# EAGLE schematic padaukprog (EAGLE 6.4)
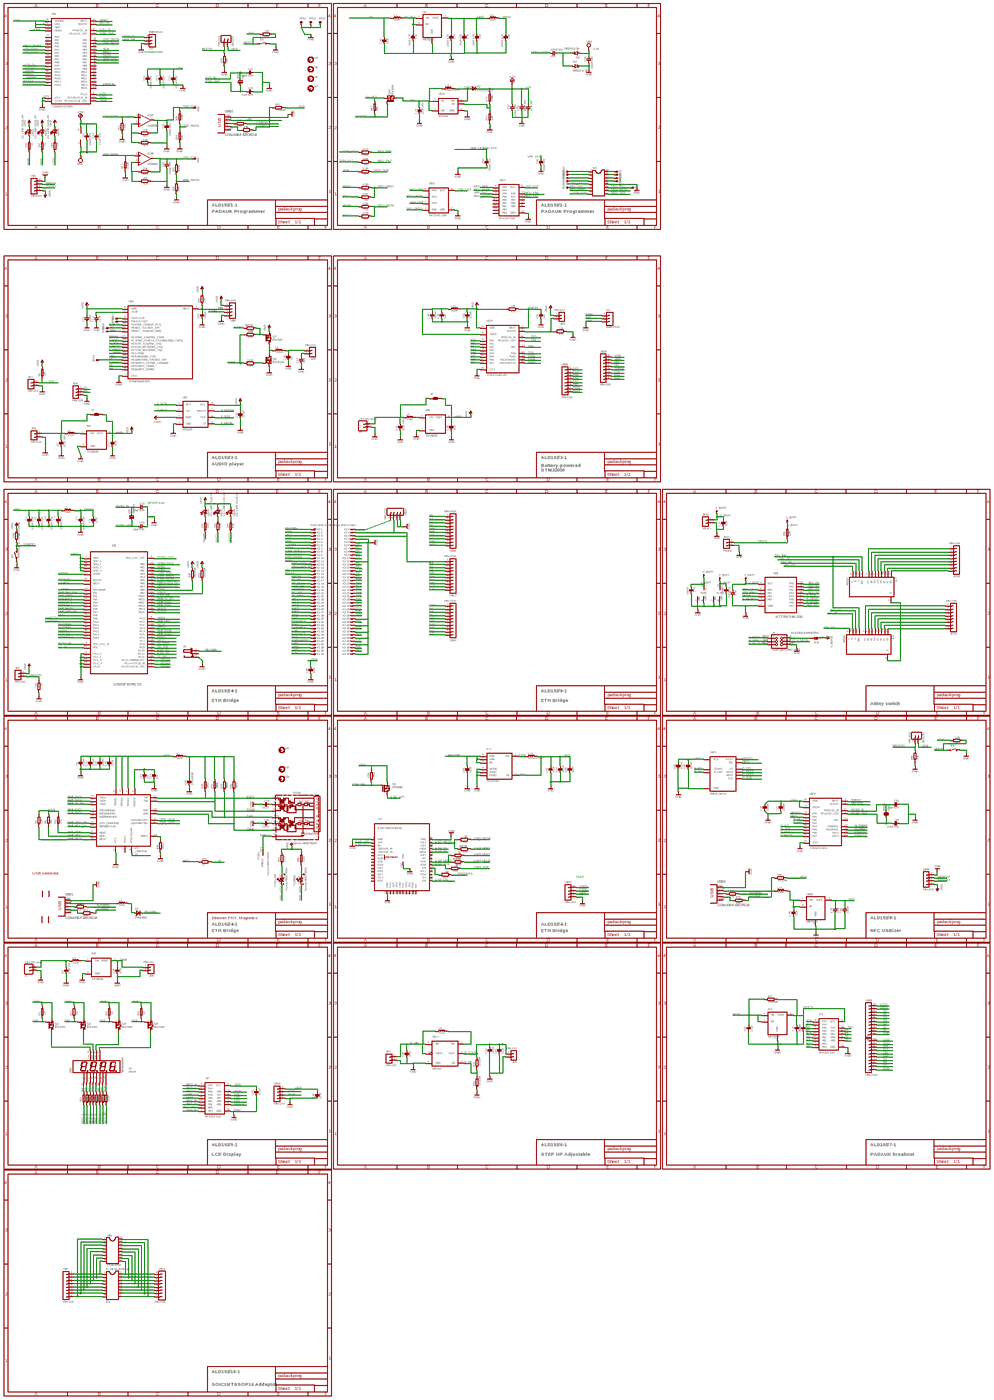
[diagram p0: schematic, sheet 1, overview]
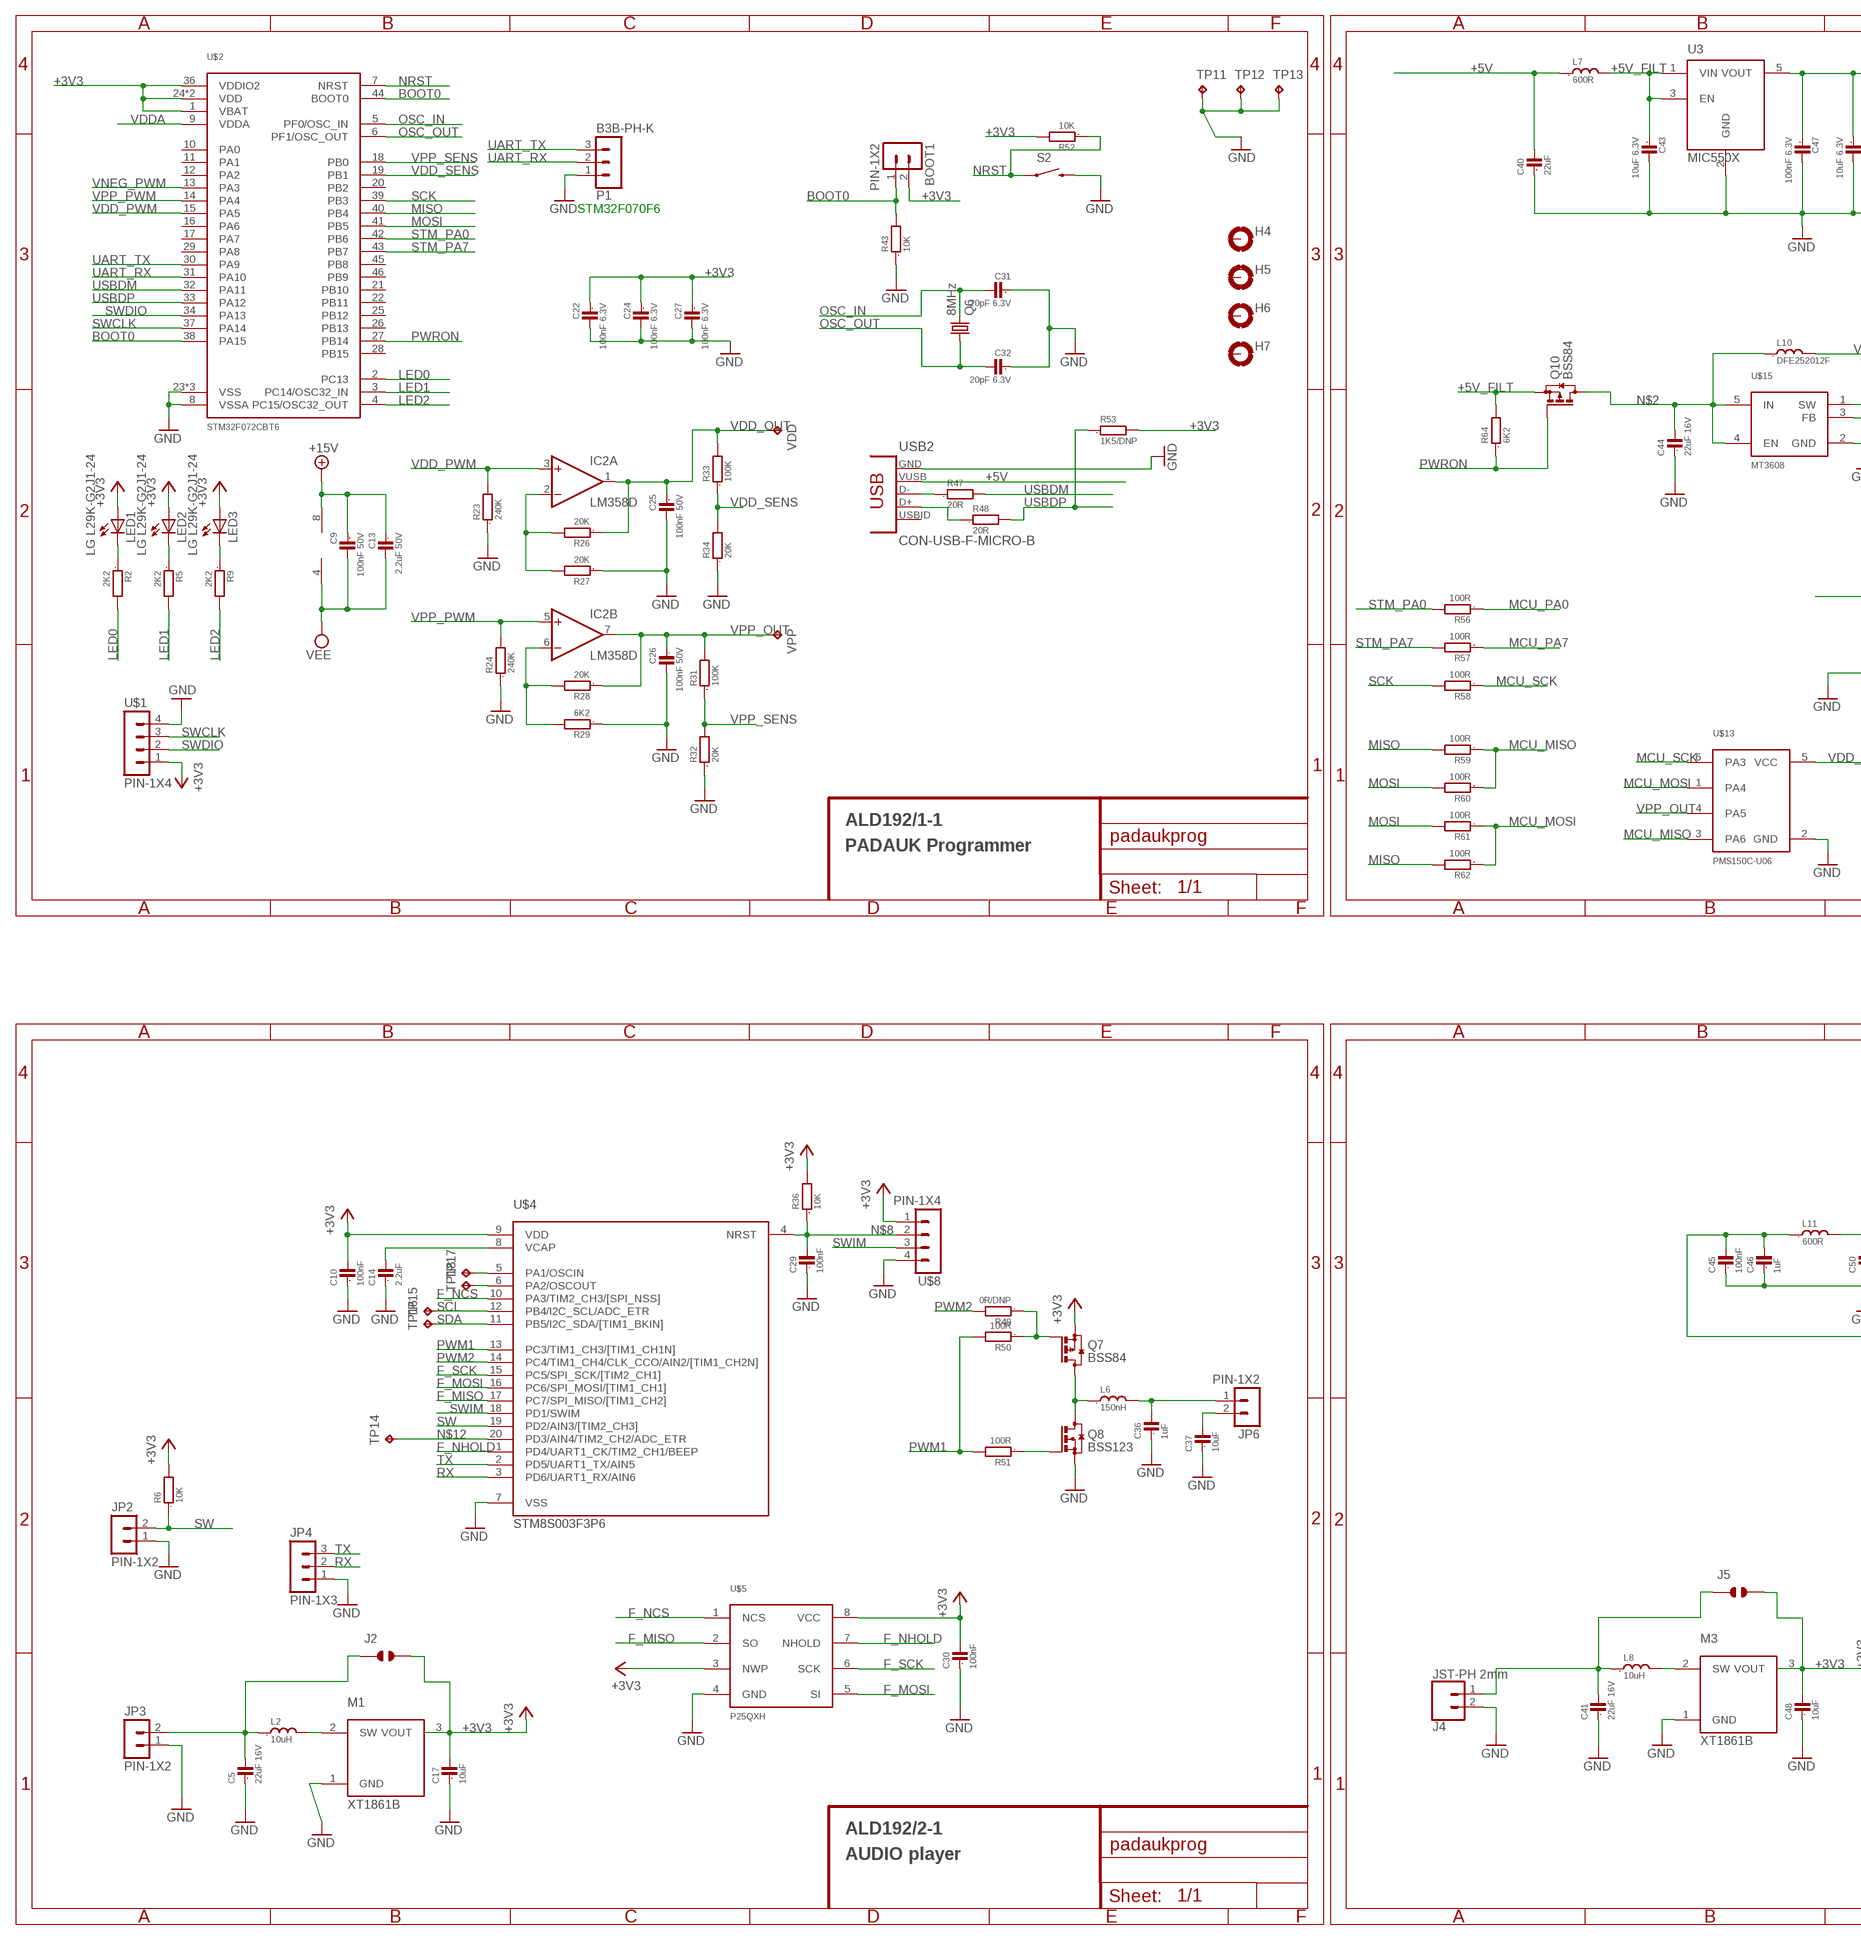
[diagram p1: schematic, sheet 1, part 1 of 7]
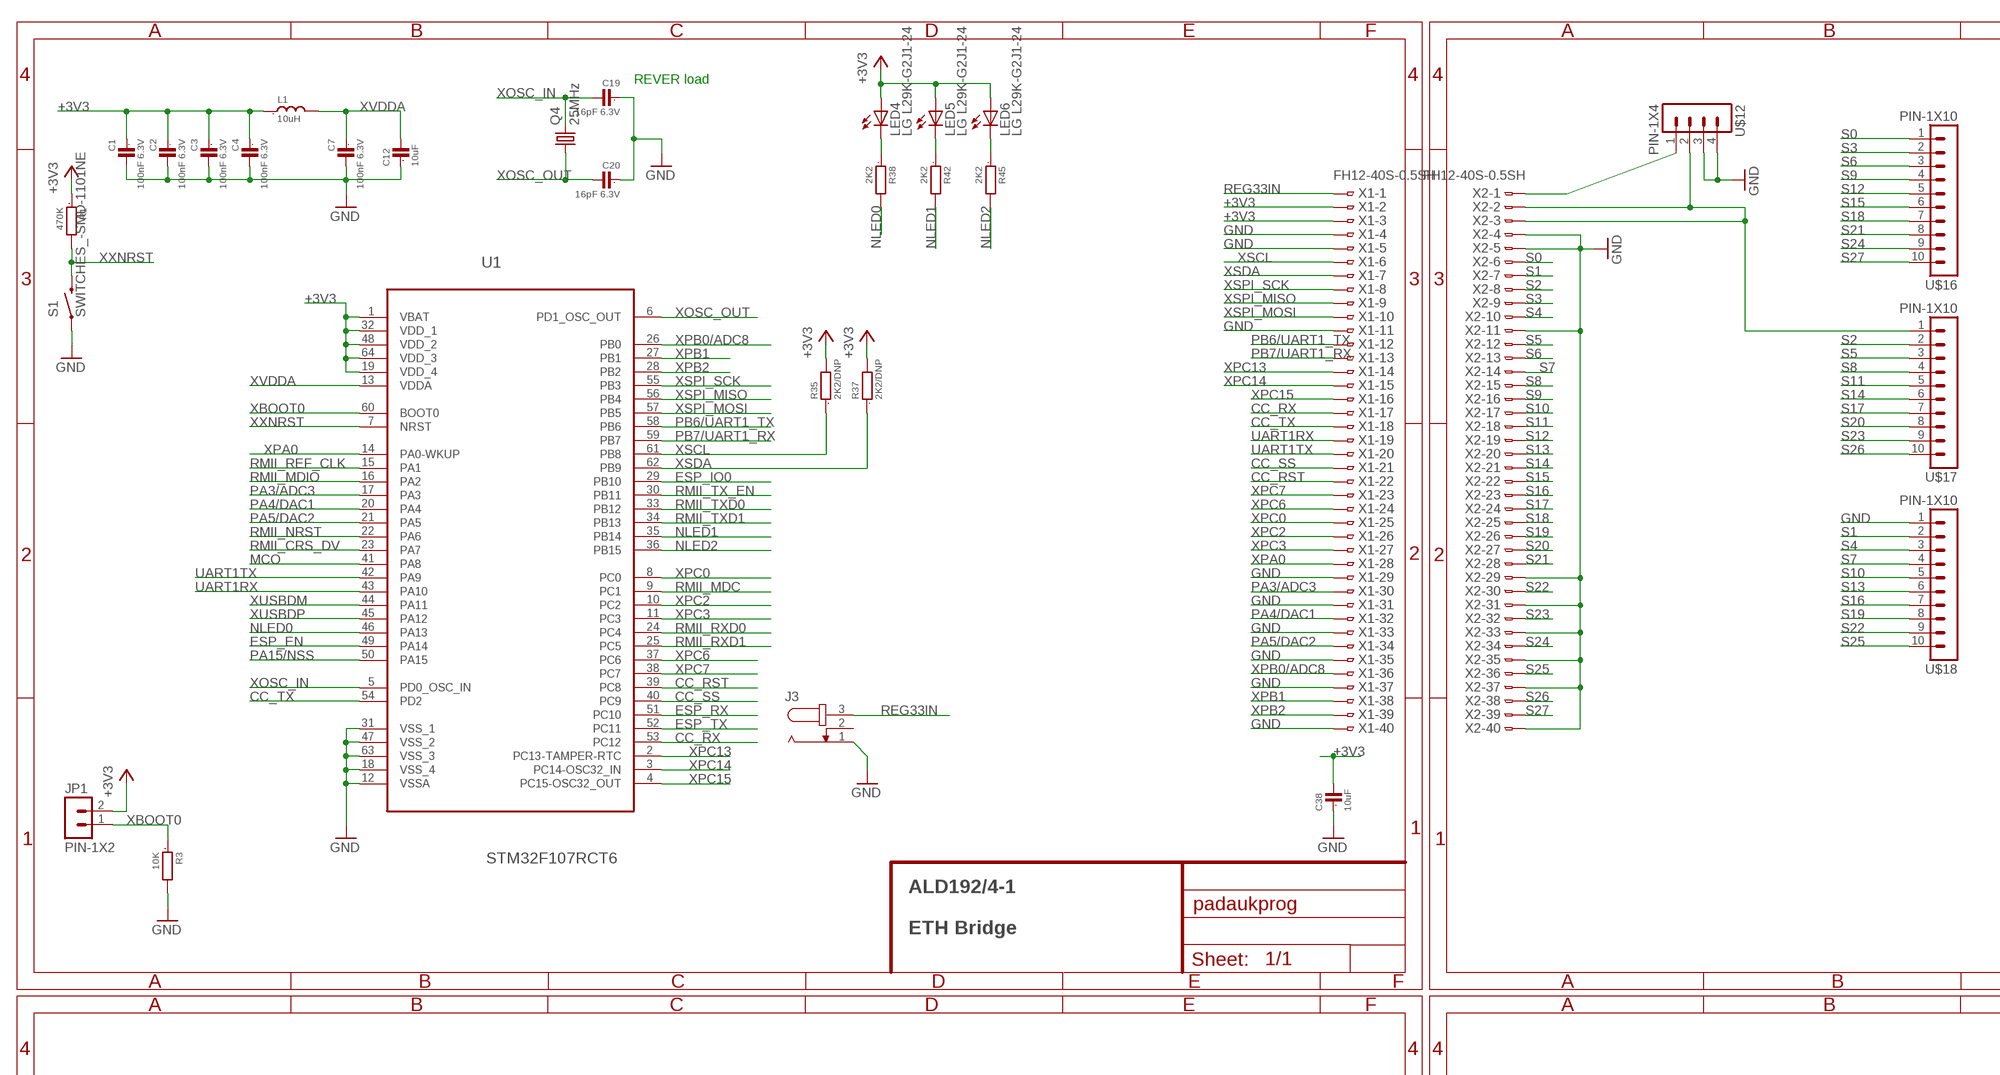
[diagram p2: schematic, sheet 1, part 2 of 7]
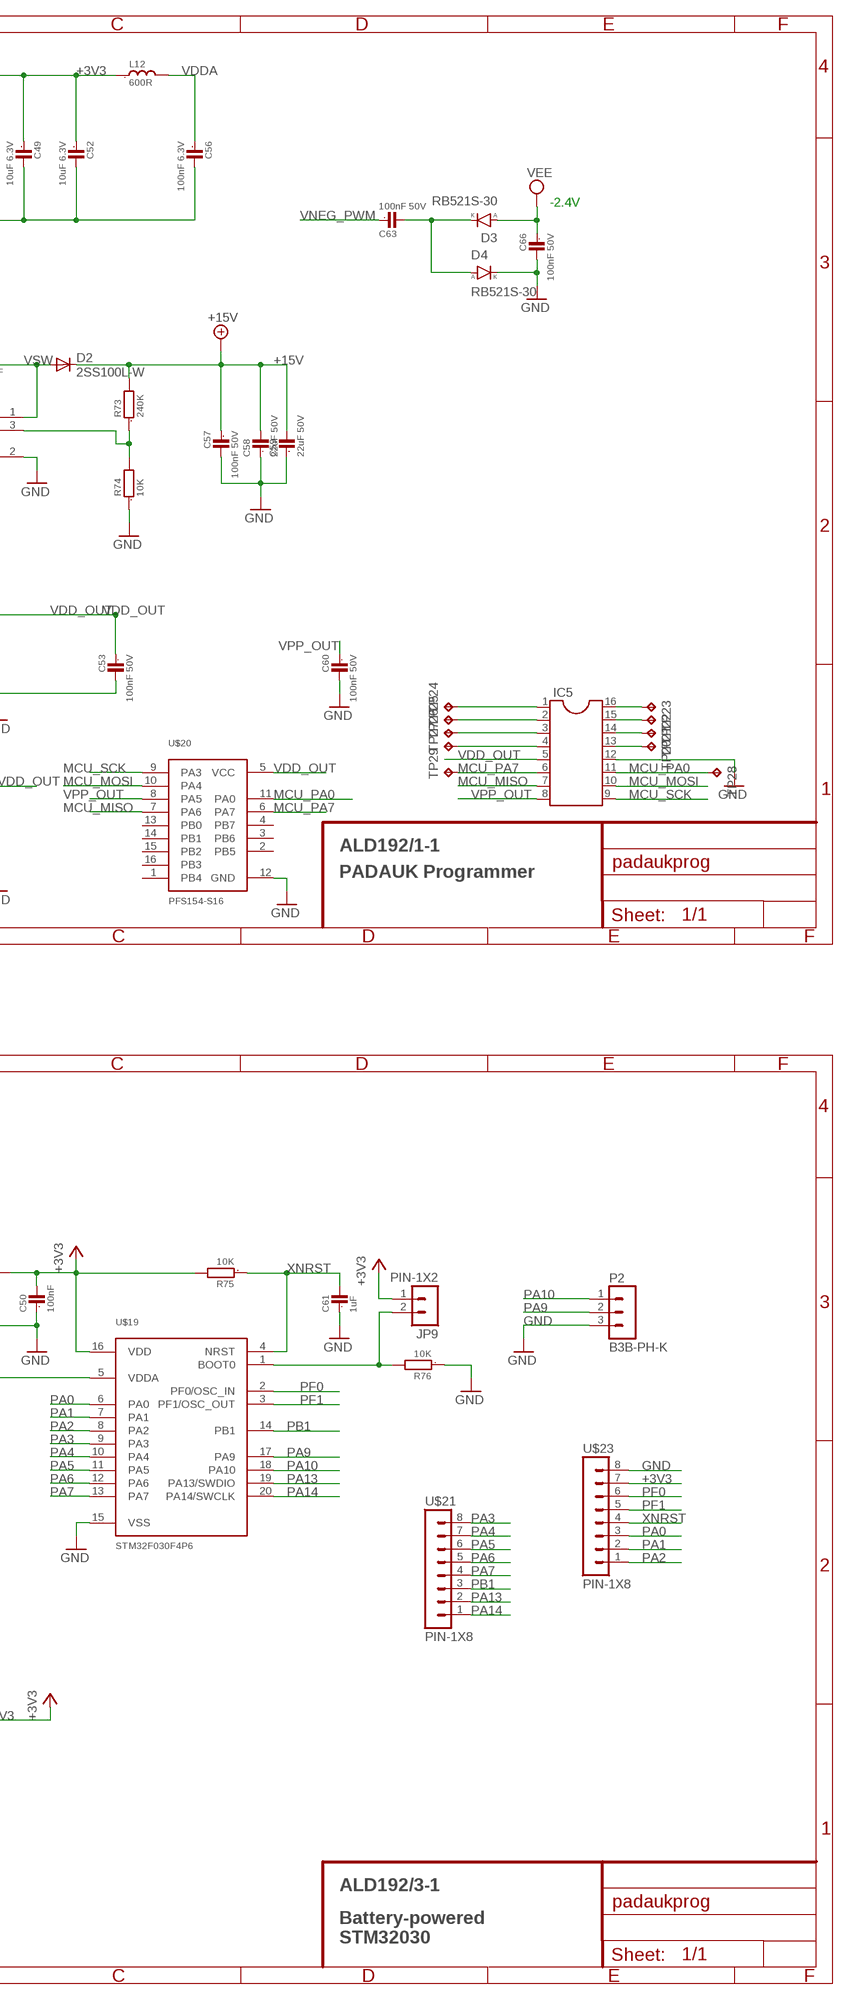
[diagram p3: schematic, sheet 1, part 3 of 7]
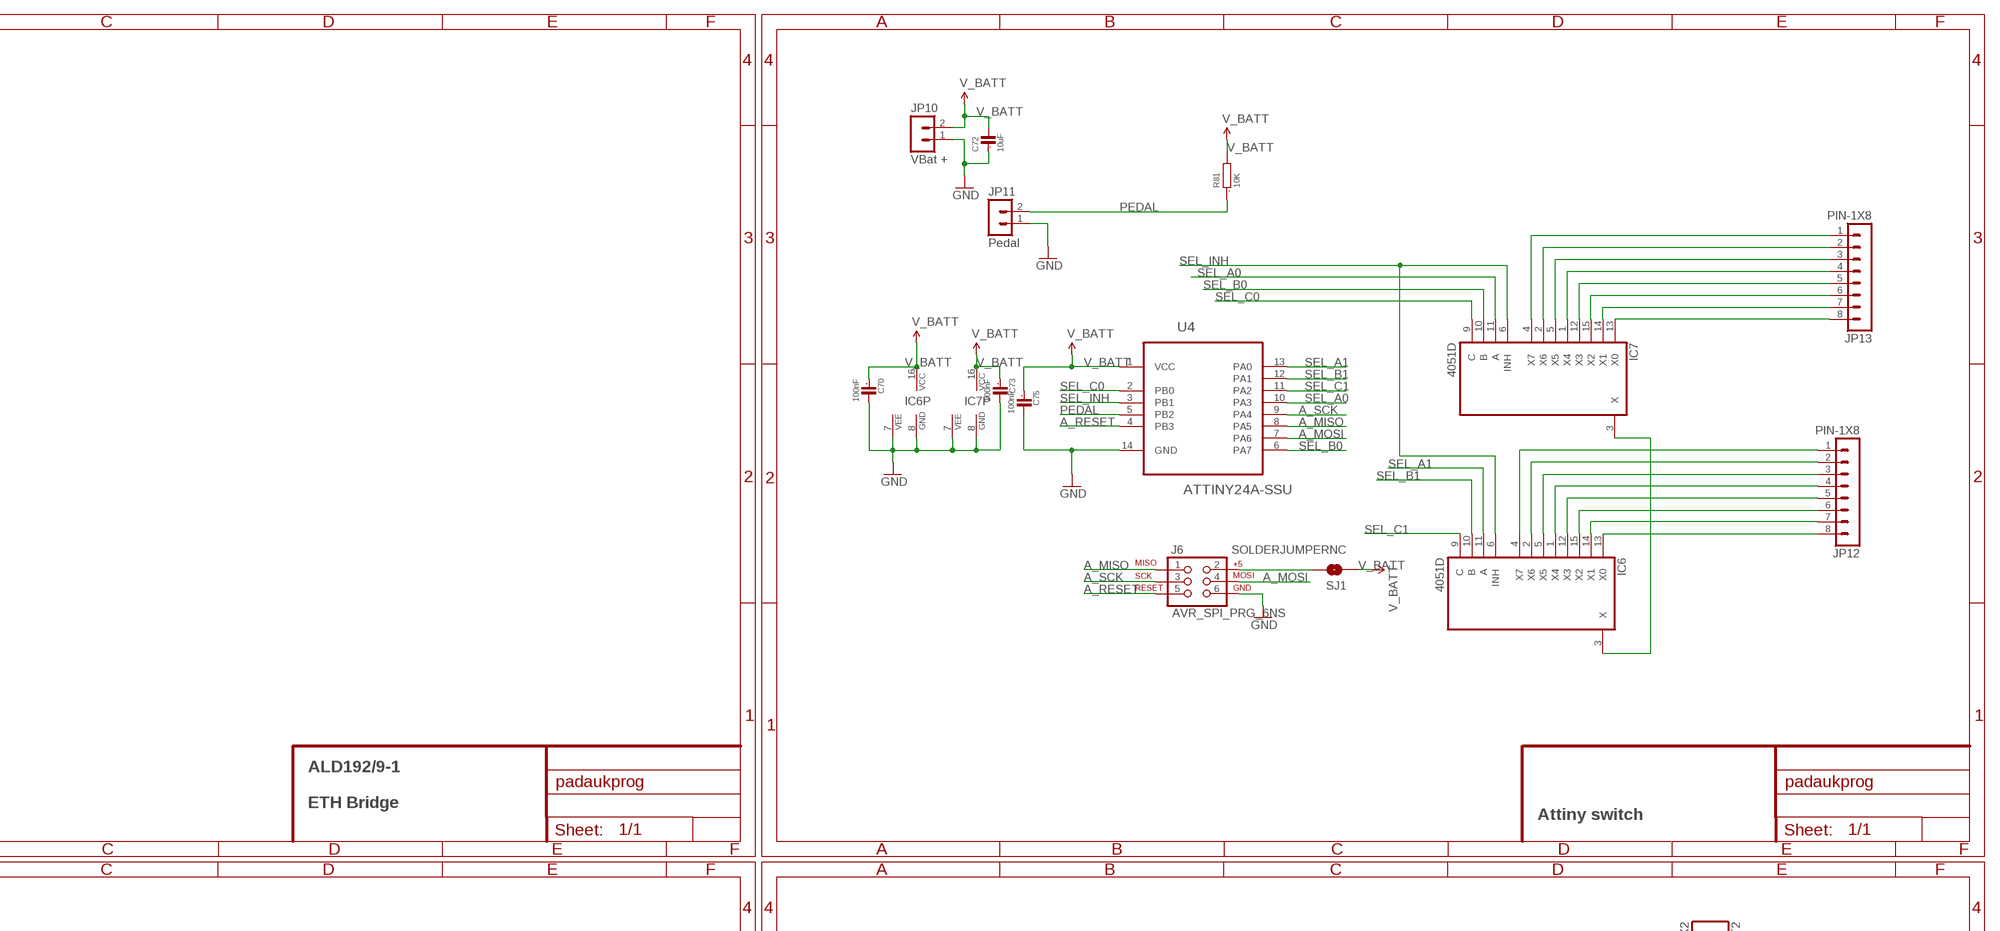
[diagram p4: schematic, sheet 1, part 4 of 7]
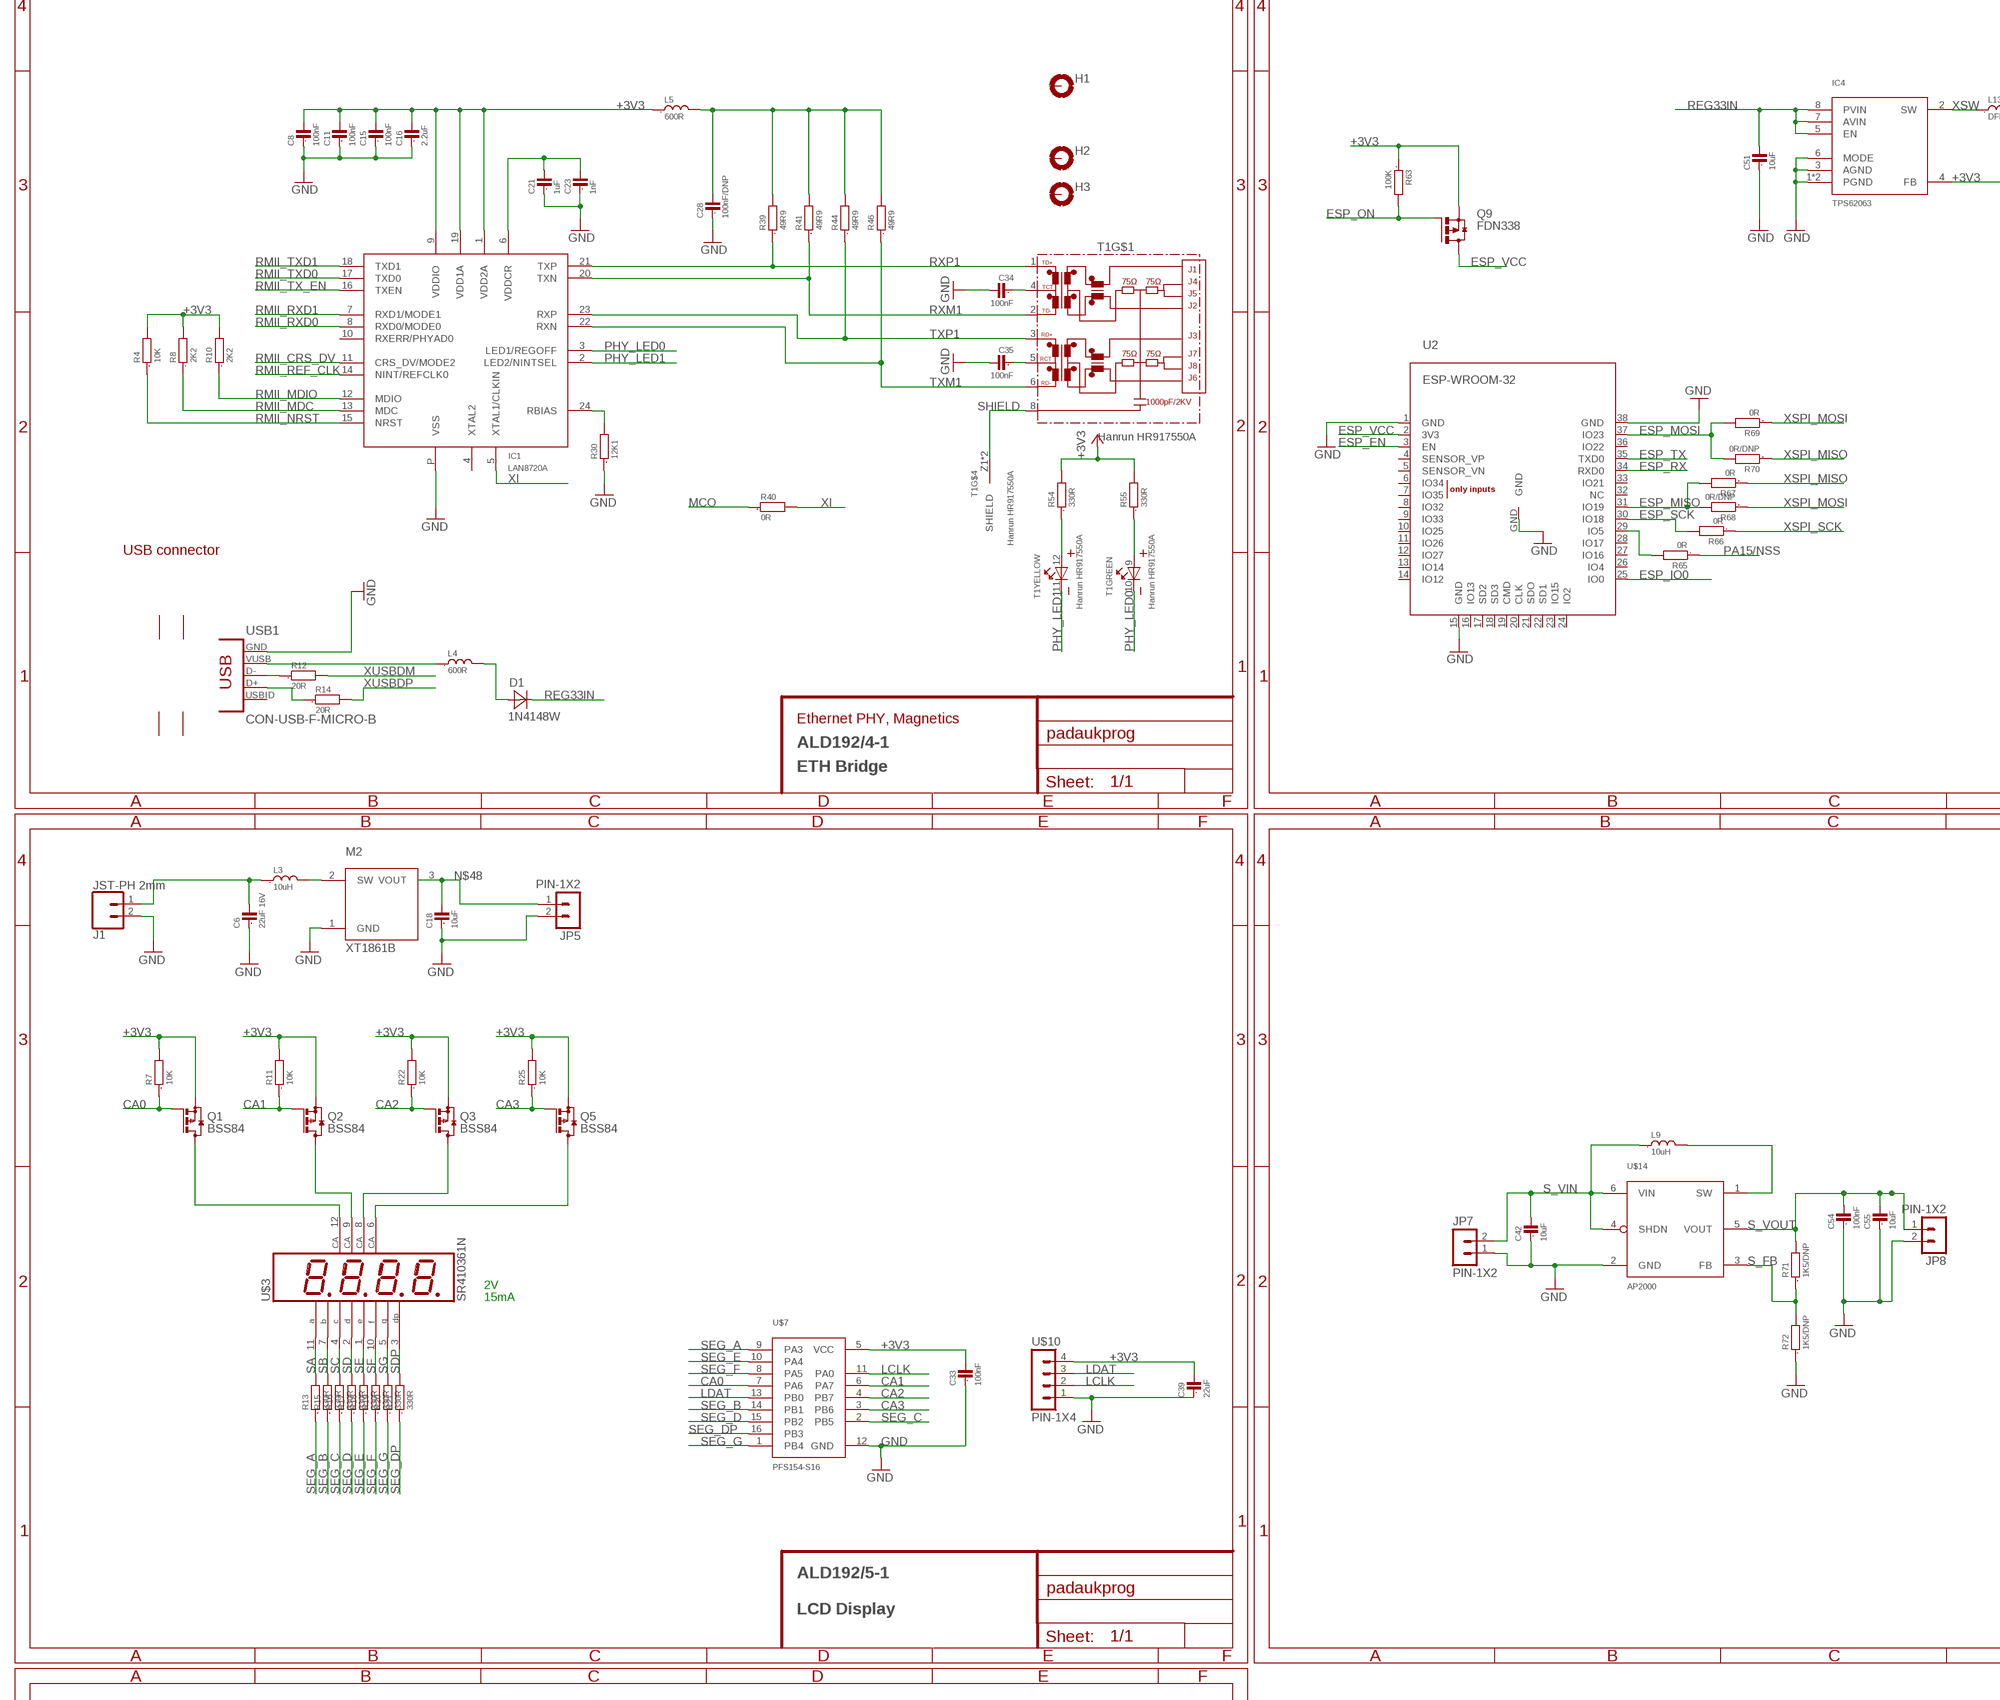
[diagram p5: schematic, sheet 1, part 5 of 7]
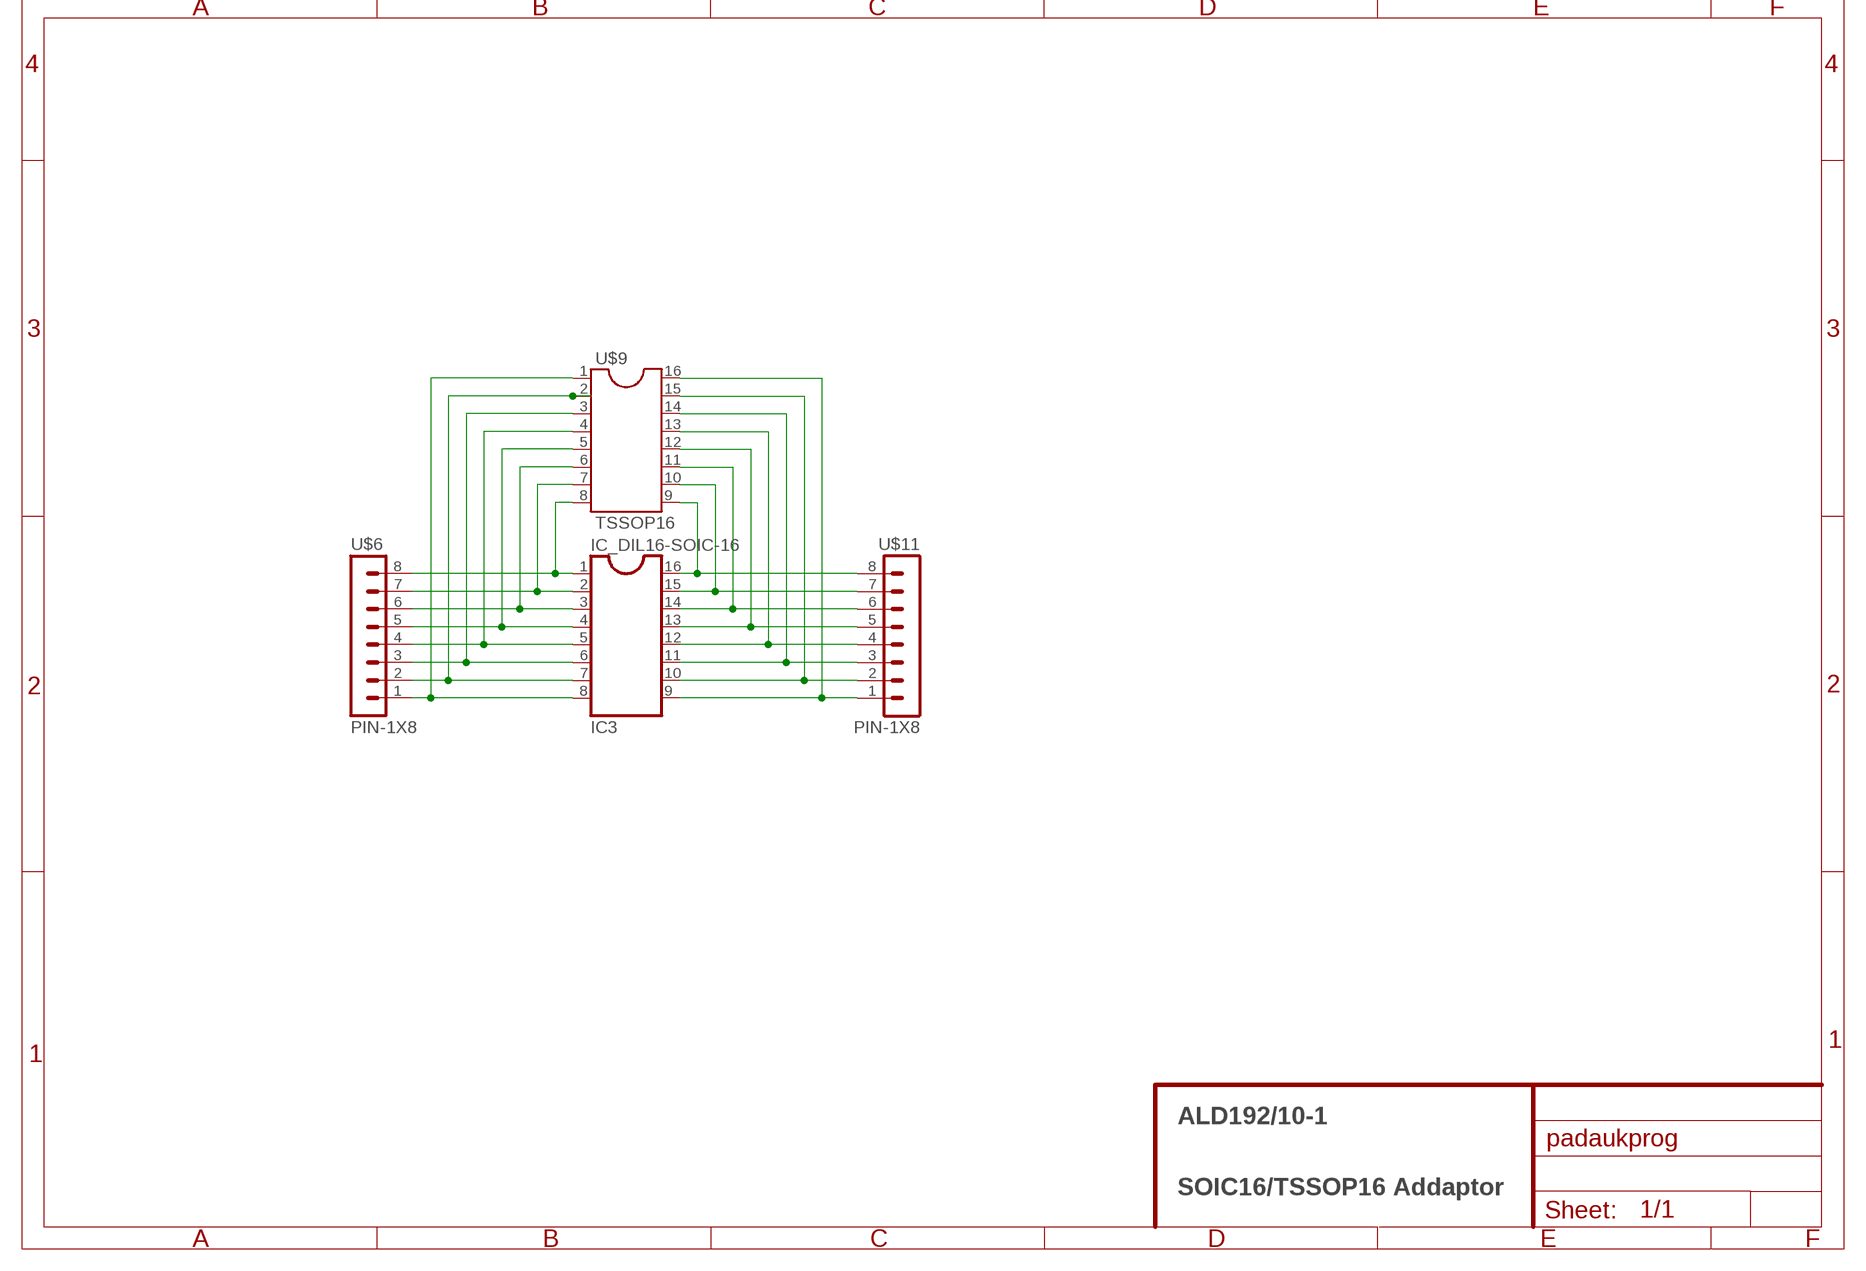
[diagram p6: schematic, sheet 1, part 6 of 7]
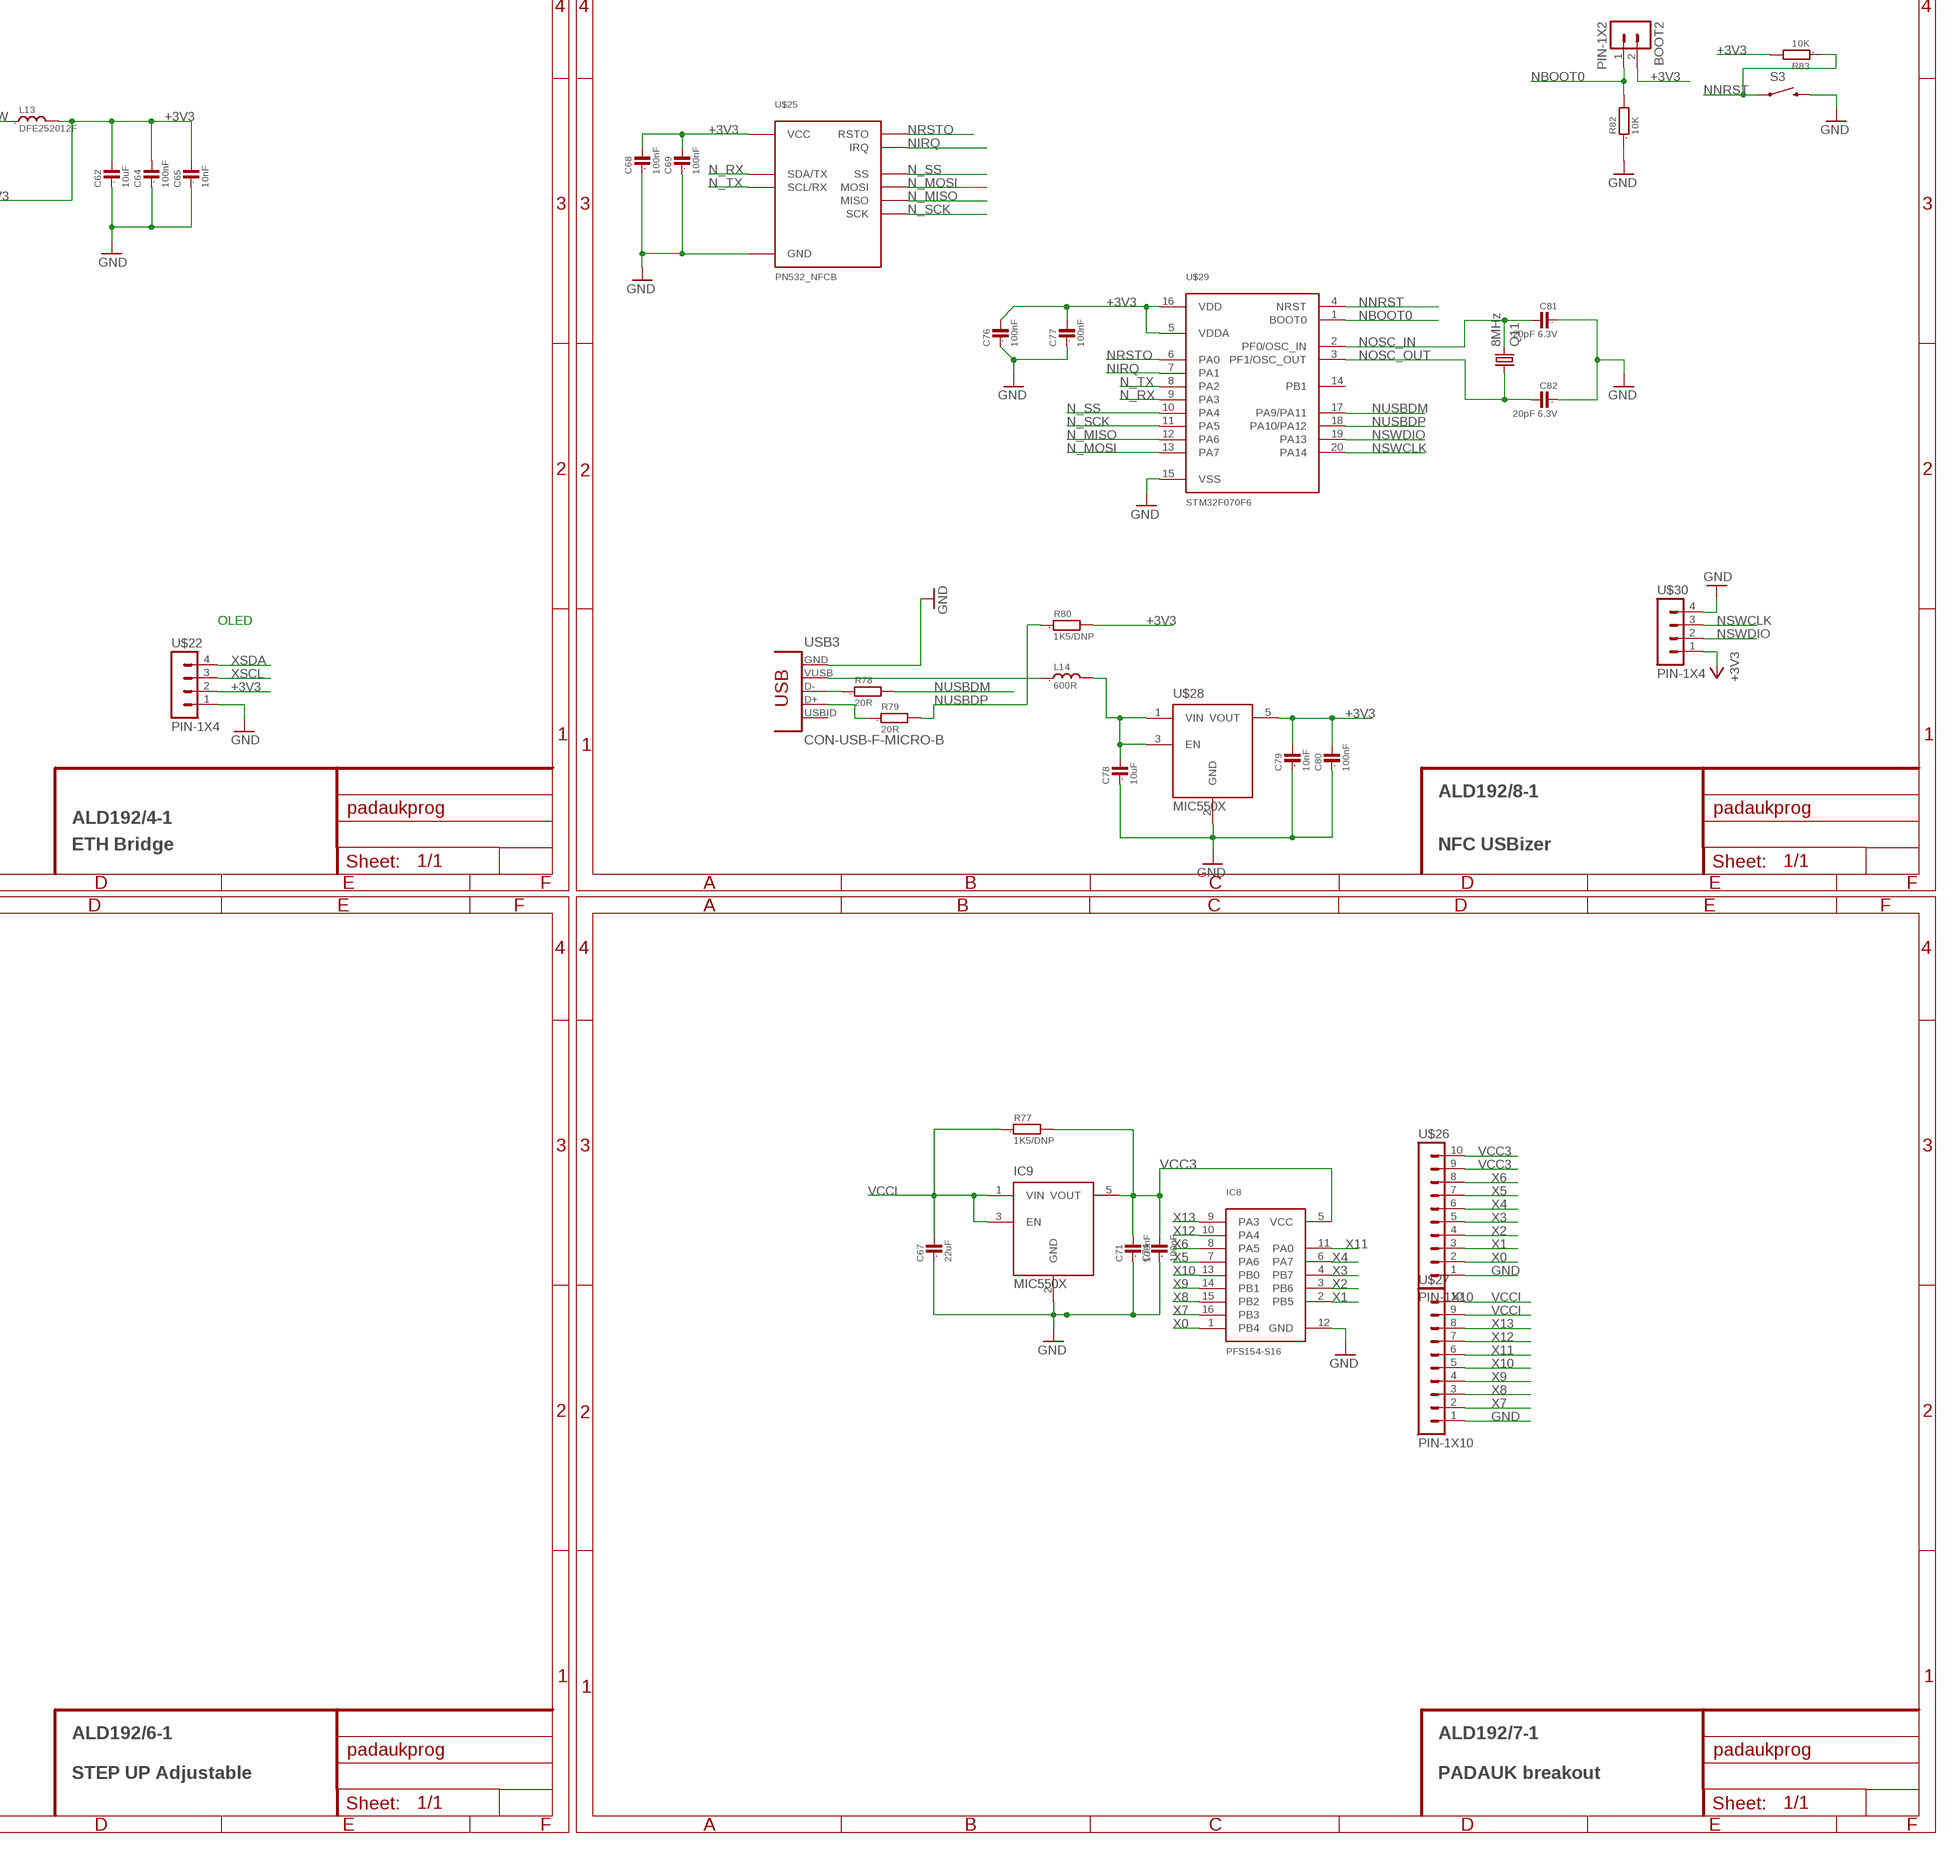
[diagram p7: schematic, sheet 1, part 7 of 7]

## Parts
BOOT1  PIN-1X2  [PIN-1X2]
BOOT2  PIN-1X2  [PIN-1X2]
C1  100nF 6.3V  C0603  [0603]
C2  100nF 6.3V  C0603  [0603]
C3  100nF 6.3V  C0603  [0603]
C4  100nF 6.3V  C0603  [0603]
C5  22uF 16V  C0805  [0805]
C6  22uF 16V  C0805  [0805]
C7  100nF 6.3V  C0603  [0603]
C8  100nF  C0603  [0603]
C9  100nF 50V  C0603  [0603]
C10  100nF  C0603  [0603]
C11  100nF  C0603  [0603]
C12  10uF  C0603  [0603]
C13  2.2uF 50V  C0805  [0805]
C14  2.2uF  C0603  [0603]
C15  100nF  C0603  [0603]
C16  2.2uF  C0805  [0805]
C17  10uF  C0603  [0603]
C18  10uF  C0603  [0603]
C19  16pF 6.3V  C0603  [0603]
C20  16pF 6.3V  C0603  [0603]
C21  1uF  C0603  [0603]
C22  100nF 6.3V  C0603  [0603]
C23  1nF  C0603  [0603]
C24  100nF 6.3V  C0603  [0603]
C25  100nF 50V  C0603  [0603]
C26  100nF 50V  C0603  [0603]
C27  100nF 6.3V  C0603  [0603]
C28  100nF/DNP  C0603  [0603]
C29  100nF  C0603  [0603]
C30  100nF  C0603  [0603]
C31  20pF 6.3V  C0603  [0603]
C32  20pF 6.3V  C0603  [0603]
C33  100nF  C0603  [0603]
C34  100nF  C0603  [0603]
C35  100nF  C0603  [0603]
C36  1uF  C0603  [0603]
C37  10uF  C0805  [0805]
C38  10uF  C0603  [0603]
C39  22uF  C0805  [0805]
C40  22uF  C0805  [0805]
C41  22uF 16V  C0805  [0805]
C42  10uF  C0805  [0805]
C43  10uF 6.3V  C0603  [0603]
C44  22uF 16V  C0805  [0805]
C45  100nF  C0603  [0603]
C46  1uF  C0603  [0603]
C47  100nF 6.3V  C0603  [0603]
C48  10uF  C0603  [0603]
C49  10uF 6.3V  C0603  [0603]
C50  100nF  C0603  [0603]
C51  10uF  C0805  [0805]
C52  10uF 6.3V  C0603  [0603]
C53  100nF 50V  C0603  [0603]
C54  100nF  C0603  [0603]
C55  10uF  C0805  [0805]
C56  100nF 6.3V  C0603  [0603]
C57  100nF 50V  C0603  [0603]
C58  22uF 50V  C0805  [0805]
C59  22uF 50V  C0805  [0805]
C60  100nF 50V  C0603  [0603]
C61  1uF  C0603  [0603]
C62  10uF  C0805  [0805]
C63  100nF 50V  C0603  [0603]
C64  100nF  C0603  [0603]
C65  10nF  C0603  [0603]
C66  100nF 50V  C0603  [0603]
C67  22uF  C0805  [0805]
C68  100nF  C0603  [0603]
C69  100nF  C0603  [0603]
C70  100nF  C0603  [0603]
C71  100nF  C0603  [0603]
C72  10uF  C0805  [0805]
C73  100nF  C0603  [0603]
C74  100nF  C0603  [0603]
C75  100nF  C0603  [0603]
C76  100nF  C0603  [0603]
C77  100nF  C0603  [0603]
C78  10uF  C0805  [0805]
C79  10nF  C0603  [0603]
C80  100nF  C0603  [0603]
C81  20pF 6.3V  C0603  [0603]
C82  20pF 6.3V  C0603  [0603]
D1  1N4148W  [SOD-123]
D2  2SS100L-W  DIODE-SOD-123  [SOD-123]
D3  RB521S-30  DIODE-SCHOTTKY_SOD523  [SOD523]
D4  RB521S-30  DIODE-SCHOTTKY_SOD523  [SOD523]
H1  MOUNT-PAD-ROUND3.2  [3,2-PAD]
H2  MOUNT-PAD-ROUND3.2  [3,2-PAD]
H3  MOUNT-PAD-ROUND3.2  [3,2-PAD]
H4  MOUNT-PAD-ROUND3.2  [3,2-PAD]
H5  MOUNT-PAD-ROUND3.2  [3,2-PAD]
H6  MOUNT-PAD-ROUND3.2  [3,2-PAD]
H7  MOUNT-PAD-ROUND3.2  [3,2-PAD]
IC1  LAN8720A  [QFN24_4MM_X_4MM]
IC2  LM358D  [SO08]
IC3  IC_DIL16-SOIC-16  [SOIC-16]
IC4  TPS62063  [WSON8-2.1X2.1]
IC5  DIL16  [DIL16@1]
IC6  4051D  [SO16]
IC7  4051D  [SO16]
IC8  PFS154-S16  [SOIC16-N]
IC9  MIC550X  [SOT23-5L]
J1  JST-PH 2mm  CONN_02JST-PTH-2  [JST-2-PTH@1]
J2  JUMPER_SOLDER_1X2  [JUMPER_SOLDER_1X2]
J3  JACK-PLUG  [SPC4078-NOSLOT]
J4  JST-PH 2mm  CONN_02JST-PTH-2  [JST-2-PTH@1]
J5  JUMPER_SOLDER_1X2  [JUMPER_SOLDER_1X2]
J6  AVR_SPI_PRG_6NS  [2X3-NS]
JP1  PIN-1X2  [PIN-1X2]
JP2  PIN-1X2  [PIN-1X2]
JP3  PIN-1X2  [PIN-1X2]
JP4  PIN-1X3  [PIN-1X3]
JP5  PIN-1X2  [PIN-1X2]
JP6  PIN-1X2  [PIN-1X2]
JP7  PIN-1X2  [PIN-1X2]
JP8  PIN-1X2  [PIN-1X2]
JP9  PIN-1X2  [PIN-1X2]
JP10  VBat +  PIN-1X2  [PIN-1X2]
JP11  Pedal  PIN-1X2  [PIN-1X2]
JP12  PIN-1X8  [PIN-1X8]
JP13  PIN-1X8  [PIN-1X8]
L1  10uH  L0805  [0805]
L2  10uH  L0805  [0805]
L3  10uH  L0805  [0805]
L4  600R  L0805  [0805]
L5  600R  L0805  [0805]
L6  150nH  L0805  [0805]
L7  600R  L0805  [0805]
L8  10uH  L0805  [0805]
L9  10uH  L0805  [0805]
L10  DFE252012F  [L2520]
L11  600R  L0805  [0805]
L12  600R  L0805  [0805]
L13  DFE252012F  [L2520]
L14  600R  L0805  [0805]
LED1  LG L29K-G2J1-24  LED-0603  [LED-603]
LED2  LG L29K-G2J1-24  LED-0603  [LED-603]
LED3  LG L29K-G2J1-24  LED-0603  [LED-603]
LED4  LG L29K-G2J1-24  LED-0603  [LED-603]
LED5  LG L29K-G2J1-24  LED-0603  [LED-603]
LED6  LG L29K-G2J1-24  LED-0603  [LED-603]
M1  XT1861B  [SOT23]
M2  XT1861B  [SOT23]
M3  XT1861B  [SOT23]
P1  B3B-PH-K  [B3B-PH-K]
P2  B3B-PH-K  [B3B-PH-K]
Q1  BSS84  [SOT23]
Q2  BSS84  [SOT23]
Q3  BSS84  [SOT23]
Q4  25MHz  CRYSTALHC49U-V  [HC49U-V]
Q5  BSS84  [SOT23]
Q6  8MHz  CRYSTALHC49U-V  [HC49U-V]
Q7  BSS84  [SOT23]
Q8  BSS123  [SOT23]
Q9  FDN338  FDN360P  [SUPER-SOT3]
Q10  BSS84  [SOT23]
Q11  8MHz  CRYSTALHC49U-V  [HC49U-V]
R1  470K  R0603  [0603]
R2  2K2  R0603  [0603]
R3  10K  R0603  [0603]
R4  10K  R0603  [0603]
R5  2K2  R0603  [0603]
R6  10K  R0603  [0603]
R7  10K  R0603  [0603]
R8  2K2  R0603  [0603]
R9  2K2  R0603  [0603]
R10  2K2  R0603  [0603]
R11  10K  R0603  [0603]
R12  20R  R0603  [0603]
R13  330R  R0603  [0603]
R14  20R  R0603  [0603]
R15  330R  R0603  [0603]
R16  330R  R0603  [0603]
R17  330R  R0603  [0603]
R18  330R  R0603  [0603]
R19  330R  R0603  [0603]
R20  330R  R0603  [0603]
R21  330R  R0603  [0603]
R22  10K  R0603  [0603]
R23  240K  R0603  [0603]
R24  240K  R0603  [0603]
R25  10K  R0603  [0603]
R26  20K  R0603  [0603]
R27  20K  R0603  [0603]
R28  20K  R0603  [0603]
R29  6K2  R0603  [0603]
R30  12K1  R0603  [0603]
R31  100K  R0603  [0603]
R32  20K  R0603  [0603]
R33  100K  R0603  [0603]
R34  20K  R0603  [0603]
R35  2K2/DNP  R0603  [0603]
R36  10K  R0603  [0603]
R37  2K2/DNP  R0603  [0603]
R38  2K2  R0603  [0603]
R39  49R9  R0603  [0603]
R40  0R  R0603  [0603]
R41  49R9  R0603  [0603]
R42  2K2  R0603  [0603]
R43  10K  R0603  [0603]
R44  49R9  R0603  [0603]
R45  2K2  R0603  [0603]
R46  49R9  R0603  [0603]
R47  20R  R0603  [0603]
R48  20R  R0603  [0603]
R49  0R/DNP  R0603  [0603]
R50  100R  R0603  [0603]
R51  100R  R0603  [0603]
R52  10K  R0603  [0603]
R53  1K5/DNP  R0603  [0603]
R54  330R  R0603  [0603]
R55  330R  R0603  [0603]
R56  100R  R0603  [0603]
R57  100R  R0603  [0603]
R58  100R  R0603  [0603]
R59  100R  R0603  [0603]
R60  100R  R0603  [0603]
R61  100R  R0603  [0603]
R62  100R  R0603  [0603]
R63  100K  R0603  [0603]
R64  6K2  R0603  [0603]
R65  0R  R0603  [0603]
R66  0R  R0603  [0603]
R67  0R  R0603  [0603]
R68  0R/DNP  R0603  [0603]
R69  0R  R0603  [0603]
R70  0R/DNP  R0603  [0603]
R71  1K5/DNP  R0603  [0603]
R72  1K5/DNP  R0603  [0603]
R73  240K  R0603  [0603]
R74  10K  R0603  [0603]
R75  10K  R0603  [0603]
R76  10K  R0603  [0603]
R77  1K5/DNP  R0603  [0603]
R78  20R  R0603  [0603]
R79  20R  R0603  [0603]
R80  1K5/DNP  R0603  [0603]
R81  10K  R0603  [0603]
R82  10K  R0603  [0603]
R83  10K  R0603  [0603]
S1  SWITCHES_-SMD-1101NE  [TACTILE-SWITCH-1101NE]
S2  SWITCHES_-SMD-1101NE  [TACTILE-SWITCH-1101NE]
S3  SWITCHES_-SMD-1101NE  [TACTILE-SWITCH-1101NE]
SJ1  SOLDERJUMPERNC  [SJ_2S_SMALL]
T1  Hanrun HR917550A  HR913550A  [HR13550A]
TP11  TPPAD1-13  [P1-13]
TP12  TPPAD1-13  [P1-13]
TP13  TPPAD1-13  [P1-13]
TP14  TPTP07SQ  [TP07SQ]
TP15  TPTP07SQ  [TP07SQ]
TP16  TPTP07SQ  [TP07SQ]
TP17  TPTP07SQ  [TP07SQ]
TP18  TPTP07SQ  [TP07SQ]
TP20  TPTP12SQ  [TP12SQ]
TP21  TPTP12SQ  [TP12SQ]
TP22  TPTP12SQ  [TP12SQ]
TP23  TPTP12SQ  [TP12SQ]
TP24  TPTP12SQ  [TP12SQ]
TP25  TPTP12SQ  [TP12SQ]
TP26  TPTP12SQ  [TP12SQ]
TP27  TPTP12SQ  [TP12SQ]
TP28  TPTP12SQ  [TP12SQ]
TP29  TPTP12SQ  [TP12SQ]
U1  STM32F107RCT6  [QFP50P1200X1200X160-64N]
U2  ESP-WROOM-32  [ESP-WROOM-32]
U3  MIC550X  [SOT23-5L]
U4  ATTINY24A-SSU  [SOIC127P600X175-14N]
U$1  PIN-1X4  [PIN-1X4]
U$2  STM32F072CBT6  [LQFP48]
U$3  SR410361N  [LCD_7SEG_4DIGIT]
U$4  STM8S003F3P6  [TSSOP20]
U$5  P25QXH  [SOIC8]
U$6  PIN-1X8  [PIN-1X8]
U$7  PFS154-S16  [SOIC16-N]
U$8  PIN-1X4  [PIN-1X4]
U$9  TSSOP16  [TSSOP16]
U$10  PIN-1X4  [PIN-1X4]
U$11  PIN-1X8  [PIN-1X8]
U$12  PIN-1X4  [PIN-1X4]
U$13  PMS150C-U06  [SOT23-6]
U$14  AP2000  [SOT23-6]
U$15  MT3608  [SOT23-6]
U$16  PIN-1X10  [PIN-1X10]
U$17  PIN-1X10  [PIN-1X10]
U$18  PIN-1X10  [PIN-1X10]
U$19  STM32F030F4P6  [TSSOP20]
U$20  PFS154-S16  [SOIC16-N]
U$21  PIN-1X8  [PIN-1X8]
U$22  PIN-1X4  [PIN-1X4]
U$23  PIN-1X8  [PIN-1X8]
U$25  PN532_NFCB  [HW-147-NFC-NOHOLES]
U$26  PIN-1X10  [PIN-1X10]
U$27  PIN-1X10  [PIN-1X10]
U$28  MIC550X  [SOT23-5L]
U$29  STM32F070F6  [TSSOP20]
U$30  PIN-1X4  [PIN-1X4]
USB1  CON-USB-F-MICRO-B  [CONN_USB_MICRO-B]
USB2  CON-USB-F-MICRO-B  [CONN_USB_MICRO-B]
USB3  CON-USB-F-MICRO-B  [CONN_USB_MICRO-B]
VDD  TPTP10R  [TP10R]
VPP  TPTP10R  [TP10R]
X1  FH12-40S-0.5SH  [FH12-40S-0.5SH]
X2  FH12-40S-0.5SH  [FH12-40S-0.5SH]

## Nets
+3V3 [power]: BOOT1.2 BOOT2.2 C1.1 C2.1 C3.1 C4.1 C8.2 C10.2 C11.2 C15.2 C16.2 C17.2 C22.1 C24.1 C27.1 C30.2 C33.2 C38.2 C39.2 C47.1 C48.2 C49.1 C50.2 C52.1 C62.2 C64.2 C65.2 C68.2 C69.2 C76.2 C77.2 C79.2 C80.2 IC1.1(VDD2A) IC1.9(VDDIO) IC1.19(VDD1A) IC4.4(FB) J2.2 J5.2 JP1.2 JP9.1 L1.1 L5.1 L11.2 L12.1 L13.P$2 LED1.A LED2.A LED3.A LED4.A LED5.A LED6.A M1.3(VOUT) M3.3(VOUT) Q1.2(S) Q2.2(S) Q3.2(S) Q5.2(S) Q7.2(S) Q9.2(S) R1.1 R4.2 R6.2 R7.2 R8.2 R10.2 R11.2 R22.2 R25.2 R35.2 R36.2 R37.2 R52.2 R53.2 R54.2 R55.2 R63.1 R75.2 R80.2 R83.2 U1.1(VBAT) U1.19(VDD_4) U1.32(VDD_1) U1.48(VDD_2) U1.64(VDD_3) U3.5(VOUT) U$1.1 U$2.1(VBAT) U$2.24(VDD) U$2.36(VDDIO2) U$2.48(VDD) U$4.9(VDD) U$5.3(NWP) U$5.8(VCC) U$7.5(VCC) U$8.1 U$10.4 U$19.16(VDD) U$22.2 U$23.7 U$25.VCC U$25.VCC1(VCC) U$28.5(VOUT) U$29.5(VDDA) U$29.16(VDD) U$30.1 X1.2 X1.3
+5V: C40.2 L7.1 USB2.P1(VUSB)
+5V_FILT: C43.1 L7.2 Q10.2(S) R64.2 U3.1(VIN) U3.3(EN)
+15V: C9.1 C13.1 C57.1 C58.2 C59.2 D2.C IC2.8(P:V+) R73.2
A_MISO: J6.1 U4.8(PA5)
A_MOSI: J6.4 U4.7(PA6)
A_RESET: J6.5 U4.4(PB3)
A_SCK: J6.3 U4.9(PA4)
BOOT0: BOOT1.1 R43.2 U$2.38(PA15) U$2.44(BOOT0)
CA0: Q1.1(G) R7.1 U$7.7(PA6)
CA1: Q2.1(G) R11.1 U$7.6(PA7)
CA2: Q3.1(G) R22.1 U$7.4(PB7)
CA3: Q5.1(G) R25.1 U$7.3(PB6)
CC_RST: U1.39(PC8) X1.22
CC_RX: U1.53(PC12) X1.17
CC_SS: U1.40(PC9) X1.21
CC_TX: U1.54(PD2) X1.18
ESP_EN: U1.49(PA14) U2.3(EN)
ESP_IO0: U1.29(PB10) U2.25(IO0)
ESP_MISO: R67.2 R68.2 U2.31(IO19)
ESP_MOSI: R69.2 R70.2 U2.37(IO23)
ESP_ON: Q9.1(G) R63.2
ESP_RX: U1.51(PC10) U2.34(RXD0)
ESP_SCK: R66.2 U2.30(IO18)
ESP_TX: U1.52(PC11) U2.35(TXD0)
ESP_VCC: Q9.3(D) U2.2(3V3)
F_MISO: U$4.17(PC7/SPI_MISO/[TIM1_CH2]) U$5.2(SO)
F_MOSI: U$4.16(PC6/SPI_MOSI/[TIM1_CH1]) U$5.5(SI)
F_NCS: U$4.10(PA3/TIM2_CH3/[SPI_NSS]) U$5.1(NCS)
F_NHOLD: U$4.1(PD4/UART1_CK/TIM2_CH1/BEEP) U$5.7(NHOLD)
F_SCK: U$4.15(PC5/SPI_SCK/[TIM2_CH1]) U$5.6(SCK)
GND: C1.2 C2.2 C3.2 C4.2 C5.1 C6.1 C7.2 C8.1 C10.1 C11.1 C12.1 C14.1 C15.1 C16.1 C17.1 C18.1 C19.1 C20.1 C21.1 C22.2 C23.1 C24.2 C25.2 C26.2 C27.2 C28.1 C29.1 C30.1 C31.1 C32.1 C33.1 C34.2 C35.2 C36.1 C37.1 C38.1 C39.1 C40.1 C41.1 C42.1 C43.2 C44.1 C45.1 C46.1 C47.2 C48.1 C49.2 C50.1 C51.1 C52.2 C53.2 C54.1 C55.1 C56.2 C57.2 C58.1 C59.1 C60.2 C61.1 C62.1 C64.1 C65.1 C66.2 C67.1 C68.1 C69.1 C70.2 C71.1 C72.1 C73.2 C74.1 C75.2 C76.1 C77.1 C78.1 C79.1 C80.1 C81.1 C82.1 D4.K IC1.P(VSS) IC4.1(PGND) IC4.3(AGND) IC4.6(MODE) IC4.EXP(PGND) IC5.12 IC6.7(VEE) IC6.8(GND) IC7.7(VEE) IC7.8(GND) IC8.12(GND) IC9.2(GND) J1.2 J3.1 J4.2 J6.6 JP2.1 JP3.1 JP4.1 JP5.2 JP7.1 JP8.2 JP10.1 JP11.1 M1.1(GND) M2.1(GND) M3.1(GND) P1.1 P2.3 Q8.2(S) R3.2 R23.1 R24.1 R27.1 R29.1 R30.1 R32.1 R34.1 R43.1 R72.1 R74.1 R76.1 R82.1 S1.P$1 S2.P$2 S3.P$2 TP11.TP TP12.TP TP13.TP U1.12(VSSA) U1.18(VSS_4) U1.31(VSS_1) U1.47(VSS_2) U1.63(VSS_3) U2.1(GND) U2.15(GND) U2.38(GND) U2.GND U3.2(GND) U4.14(GND) U$1.4 U$2.8(VSSA) U$2.23(VSS) U$2.35(VSS) U$2.47(VSS) U$4.7(VSS) U$5.4(GND) U$7.12(GND) U$8.4 U$10.1 U$12.3 U$12.4 U$13.2(GND) U$14.2(GND) U$15.2(GND) U$18.1 U$19.15(VSS) U$20.12(GND) U$22.1 U$23.8 U$25.GND U$25.GND1(GND) U$26.1 U$27.1 U$28.2(GND) U$29.15(VSS) U$30.4 USB1.P5(GND) USB2.P5(GND) USB3.P5(GND) X1.4 X1.5 X1.11 X1.29 X1.31 X1.33 X1.35 X1.37 X1.40 X2.4 X2.5 X2.11 X2.29 X2.31 X2.33 X2.35 X2.37 X2.40
LCLK: U$7.11(PA0) U$10.2
LDAT: U$7.13(PB0) U$10.3
LED0: R2.2 U$2.2(PC13)
LED1: R5.2 U$2.3(PC14/OSC32_IN)
LED2: R9.2 U$2.4(PC15/OSC32_OUT)
MCO: R40.1 U1.41(PA8)
MCU_MISO: IC5.7 R59.1 R60.1 U$13.3(PA6) U$20.7(PA6)
MCU_MOSI: IC5.10 R61.1 R62.1 U$13.1(PA4) U$20.10(PA4)
MCU_PA0: IC5.11 R56.1 TP28.TP U$20.11(PA0)
MCU_PA7: IC5.6 R57.1 TP29.TP U$20.6(PA7)
MCU_SCK: IC5.9 R58.1 U$13.6(PA3) U$20.9(PA3)
MISO: R59.2 R62.2 U$2.40(PB4)
MOSI: R60.2 R61.2 U$2.41(PB5)
N$1: LED2.C R5.1
N$2: C44.2 L10.P$1 Q10.3(D) U$15.4(EN) U$15.5(IN)
N$3: LED3.C R9.1
N$4: L2.2 M1.2(SW)
N$5: C5.2 J2.1 JP3.2 L2.1
N$6: TP17.TP U$4.5(PA1/OSCIN)
N$7: C14.2 U$4.8(VCAP)
N$8: C29.2 R36.1 U$4.4(NRST) U$8.2
N$9: TP18.TP U$4.6(PA2/OSCOUT)
N$10: C45.2 C46.2 L11.1 U$19.5(VDDA)
N$11: C36.2 JP6.1 L6.2
N$12: TP14.TP U$4.20(PD3/AIN4/TIM2_CH2/ADC_ETR)
N$13: C41.2 J4.1 J5.1 L8.1
N$14: C37.2 JP6.2
N$15: L6.1 Q7.3(D) Q8.3(D)
N$16: L8.2 M3.2(SW)
N$17: L14.1 USB3.P1(VUSB)
N$18: Q7.1(G) R49.1 R50.1
N$19: Q8.1(G) R51.1
N$20: R12.1 USB1.P2(D-)
N$21: LED1.C R2.1
N$22: R14.1 USB1.P3(D+)
N$23: JP9.2 R76.2 U$19.1(BOOT0)
N$24: U$12.1 X2.1
N$25: R65.2 U2.29(IO5)
N$26: LED4.C R38.1
N$27: LED5.C R42.1
N$28: LED6.C R45.1
N$29: R78.1 USB3.P2(D-)
N$30: IC5.16 TP23.TP
N$31: IC5.15 TP22.TP
N$32: IC5.14 TP21.TP
N$33: R79.1 USB3.P3(D+)
N$34: IC6.3(X) IC7.3(X)
N$35: IC5.13 TP20.TP
N$36: R47.1 USB2.P2(D-)
N$37: R48.1 USB2.P3(D+)
N$38: IC6.4(X7) JP12.1
N$39: L4.1 USB1.P1(VUSB)
N$40: IC1.24(RBIAS) R30.2
N$41: C6.2 J1.1 L3.1
N$42: R73.1 R74.2 U$15.3(FB)
N$43: C63.2 D3.K D4.A
N$44: C35.1 T1.5
N$45: C34.1 T1.4
N$46: R54.1 T1.12(YELLOW:A)
N$47: L3.2 M2.2(SW)
N$48 [power]: C18.2 JP5.1 M2.3(VOUT)
N$49: IC7.13(X0) JP13.8
N$50: IC2.6(B:-IN) R28.2 R29.2
N$51: IC2.2(A:-IN) R26.2 R27.2
N$52: IC6.13(X0) JP12.8
N$53: R55.1 T1.9(GREEN:A)
N$54: IC5.1 TP24.TP
N$55: IC5.2 TP25.TP
N$56: C28.2 L5.2 R39.2 R41.2 R44.2 R46.2
N$57: IC5.3 TP26.TP
N$58: C21.2 C23.2 IC1.6(VDDCR)
N$59: IC5.4 TP27.TP
N$60: IC6.14(X1) JP12.7
N$61: IC6.12(X3) JP12.5
N$62: IC6.1(X4) JP12.4
N$63: IC6.5(X5) JP12.3
N$64: IC6.2(X6) JP12.2
N$65: Q2.3(D) U$3.9(CA1)
N$66: J6.2 SJ1.2
N$67: IC7.14(X1) JP13.7
N$68: IC7.15(X2) JP13.6
N$69: IC7.12(X3) JP13.5
N$70: IC6.15(X2) JP12.6
N$71: IC7.1(X4) JP13.4
N$72: IC7.5(X5) JP13.3
N$73: IC7.2(X6) JP13.2
N$74: IC7.4(X7) JP13.1
N$75: Q3.3(D) U$3.8(CA2)
N$76: Q1.3(D) U$3.12(CA0)
N$77: Q5.3(D) U$3.6(CA3)
N$78: U$12.2 U$17.1 X2.2 X2.3
N$81: IC3.8 U$6.1 U$9.1
N$91: IC3.7 U$6.2 U$9.2
N$92: IC3.6 U$6.3 U$9.3
N$93: IC3.5 U$6.4 U$9.4
N$94: IC3.4 U$6.5 U$9.5
N$95: IC3.3 U$6.6 U$9.6
N$96: IC3.2 U$6.7 U$9.7
N$97: IC3.1 U$6.8 U$9.8
N$98: IC3.16 U$9.9 U$11.8
N$99: IC3.15 U$9.10 U$11.7
N$100: IC3.13 U$9.12 U$11.5
N$101: IC3.14 U$9.11 U$11.6
N$102: IC3.12 U$9.13 U$11.4
N$103: IC3.11 U$9.14 U$11.3
N$104: IC3.10 U$9.15 U$11.2
N$105: IC3.9 U$9.16 U$11.1
N_MISO: U$25.MISO U$29.12(PA6)
N_MOSI: U$25.MOSI U$29.13(PA7)
N_RX: U$25.SDA/TX U$29.9(PA3)
N_SCK: U$25.SCK U$29.11(PA5)
N_SS: U$25.SS U$29.10(PA4)
N_TX: U$25.SCL/RX U$29.8(PA2)
NBOOT0: BOOT2.1 R82.2 U$29.1(BOOT0)
NIRQ: U$25.IRQ U$29.7(PA1)
NLED0: R38.2 U1.46(PA13)
NLED1: R42.2 U1.35(PB14)
NLED2: R45.2 U1.36(PB15)
NNRST: R83.1 S3.P$1 U$29.4(NRST)
NOSC_IN: C81.2 Q11.2 U$29.2(PF0/OSC_IN)
NOSC_OUT: C82.2 Q11.1 U$29.3(PF1/OSC_OUT)
NRST: R52.1 S2.P$1 U$2.7(NRST)
NRSTO: U$25.RSTO U$29.6(PA0)
NSWCLK: U$29.20(PA14) U$30.3
NSWDIO: U$29.19(PA13) U$30.2
NUSBDM: R78.2 U$29.17(PA9/PA11)
NUSBDP: R79.2 R80.1 U$29.18(PA10/PA12)
OSC_IN: C31.2 Q6.2 U$2.5(PF0/OSC_IN)
OSC_OUT: C32.2 Q6.1 U$2.6(PF1/OSC_OUT)
PA0: U$19.6(PA0) U$23.3
PA1: U$19.7(PA1) U$23.2
PA2: U$19.8(PA2) U$23.1
PA3: U$19.9(PA3) U$21.8
PA3/ADC3: U1.17(PA3) X1.30
PA4: U$19.10(PA4) U$21.7
PA4/DAC1: U1.20(PA4) X1.32
PA5: U$19.11(PA5) U$21.6
PA5/DAC2: U1.21(PA5) X1.34
PA6: U$19.12(PA6) U$21.5
PA7: U$19.13(PA7) U$21.4
PA9: P2.2 U$19.17(PA9)
PA10: P2.1 U$19.18(PA10)
PA13: U$19.19(PA13/SWDIO) U$21.2
PA14: U$19.20(PA14/SWCLK) U$21.1
PA15/NSS: R65.1 U1.50(PA15)
PB1: U$19.14(PB1) U$21.3
PB6/UART1_TX: U1.58(PB6) X1.12
PB7/UART1_RX: U1.59(PB7) X1.13
PEDAL: JP11.2 R81.1 U4.5(PB2)
PF0: U$19.2(PF0/OSC_IN) U$23.6
PF1: U$19.3(PF1/OSC_OUT) U$23.5
PHY_LED0: IC1.3(LED1/REGOFF) T1.10(GREEN:K)
PHY_LED1: IC1.2(LED2/NINTSEL) T1.11(YELLOW:K)
PWM1: R50.2 R51.2 U$4.13(PC3/TIM1_CH3/[TIM1_CH1N])
PWM2: R49.2 U$4.14(PC4/TIM1_CH4/CLK_CCO/AIN2/[TIM1_CH2N])
PWRON: Q10.1(G) R64.1 U$2.27(PB14)
REG33IN: C51.2 D1.1(C) IC4.5(EN) IC4.7(AVIN) IC4.8(PVIN) J3.3 X1.1
RMII_CRS_DV: IC1.11(CRS_DV/MODE2) U1.23(PA7)
RMII_MDC: IC1.13(MDC) R8.1 U1.9(PC1)
RMII_MDIO: IC1.12(MDIO) R10.1 U1.16(PA2)
RMII_NRST: IC1.15(NRST) R4.1 U1.22(PA6)
RMII_REF_CLK: IC1.14(NINT/REFCLK0) U1.15(PA1)
RMII_RXD0: IC1.8(RXD0/MODE0) U1.24(PC4)
RMII_RXD1: IC1.7(RXD1/MODE1) U1.25(PC5)
RMII_TX_EN: IC1.16(TXEN) U1.30(PB11)
RMII_TXD0: IC1.17(TXD0) U1.33(PB12)
RMII_TXD1: IC1.18(TXD1) U1.34(PB13)
RX: JP4.2 U$4.3(PD6/UART1_RX/AIN6)
RXM1: IC1.20(TXN) R41.1 T1.2
RXP1: IC1.21(TXP) R39.1 T1.1
S0: U$16.1 X2.6
S1: U$18.2 X2.7
S2: U$17.2 X2.8
S3: U$16.2 X2.9
S4: U$18.3 X2.10
S5: U$17.3 X2.12
S6: U$16.3 X2.13
S7: U$18.4 X2.14
S8: U$17.4 X2.15
S9: U$16.4 X2.16
S10: U$18.5 X2.17
S11: U$17.5 X2.18
S12: U$16.5 X2.19
S13: U$18.6 X2.20
S14: U$17.6 X2.21
S15: U$16.6 X2.22
S16: U$18.7 X2.23
S17: U$17.7 X2.24
S18: U$16.7 X2.25
S19: U$18.8 X2.26
S20: U$17.8 X2.27
S21: U$16.8 X2.28
S22: U$18.9 X2.30
S23: U$17.9 X2.32
S24: U$16.9 X2.34
S25: U$18.10 X2.36
S26: U$17.10 X2.38
S27: U$16.10 X2.39
S_FB: R71.1 R72.2 U$14.3(FB)
S_SW: L9.2 U$14.1(SW)
S_VIN: C42.2 JP7.2 L9.1 U$14.4(SHDN) U$14.6(VIN)
S_VOUT: C54.2 C55.2 JP8.1 R71.2 U$14.5(VOUT)
SA: R13.2 U$3.11(A)
SB: R15.2 U$3.7(B)
SC: R16.2 U$3.4(C)
SCK: R58.2 U$2.39(PB3)
SCL: TP15.TP U$4.12(PB4/I2C_SCL/ADC_ETR)
SD: R17.2 U$3.2(D)
SDA: TP16.TP U$4.11(PB5/I2C_SDA/[TIM1_BKIN])
SDP: R21.2 U$3.3(DP)
SE: R18.2 U$3.1(E)
SEG_A: R13.1 U$7.9(PA3)
SEG_B: R15.1 U$7.14(PB1)
SEG_C: R16.1 U$7.2(PB5)
SEG_D: R17.1 U$7.15(PB2)
SEG_DP: R21.1 U$7.16(PB3)
SEG_E: R18.1 U$7.10(PA4)
SEG_F: R19.1 U$7.8(PA5)
SEG_G: R20.1 U$7.1(PB4)
SEL_A0: IC7.11(A) U4.10(PA3)
SEL_A1: IC6.11(A) U4.13(PA0)
SEL_B0: IC7.10(B) U4.6(PA7)
SEL_B1: IC6.10(B) U4.12(PA1)
SEL_C0: IC7.9(C) U4.2(PB0)
SEL_C1: IC6.9(C) U4.11(PA2)
SEL_INH: IC6.6(INH) IC7.6(INH) U4.3(PB1)
SF: R19.2 U$3.10(F)
SG: R20.2 U$3.5(G)
SHIELD: T1.8 T1.Z1(SHIELD) T1.Z2(SHIELD)
STM_PA0: R56.2 U$2.42(PB6)
STM_PA7: R57.2 U$2.43(PB7)
SW: JP2.2 R6.1 U$4.19(PD2/AIN3/[TIM2_CH3])
SWCLK: U$1.3 U$2.37(PA14)
SWDIO: U$1.2 U$2.34(PA13)
SWIM: U$4.18(PD1/SWIM) U$8.3
TX: JP4.3 U$4.2(PD5/UART1_TX/AIN5)
TXM1: IC1.22(RXN) R46.1 T1.6
TXP1: IC1.23(RXP) R44.1 T1.3
UART1RX: U1.43(PA10) X1.19
UART1TX: U1.42(PA9) X1.20
UART_RX: P1.2 U$2.31(PA10)
UART_TX: P1.3 U$2.30(PA9)
USBDM: R47.2 U$2.32(PA11)
USBDP: R48.2 R53.1 U$2.33(PA12)
USBPWR: D1.2(A) L4.2
USBPWR1: C78.2 L14.2 U$28.1(VIN) U$28.3(EN)
V_BATT: C70.1 C72.2 C73.1 C75.1 IC6.16(VCC) IC7.16(VCC) JP10.2 R81.2 SJ1.1 U4.1(VCC)
VCC3: C71.2 C74.2 IC8.5(VCC) IC9.5(VOUT) R77.2 U$26.9 U$26.10
VCCI: C67.2 IC9.1(VIN) IC9.3(EN) R77.1 U$27.9 U$27.10
VDD_OUT: C25.1 C53.1 IC2.1(A:OUT) IC5.5 R26.1 R33.2 U$13.5(VCC) U$20.5(VCC) VDD.TP
VDD_PWM: IC2.3(A:+IN) R23.2 U$2.15(PA5)
VDD_SENS: R33.1 R34.2 U$2.19(PB1)
VDDA: C56.1 L12.2 U$2.9(VDDA)
VEE: C9.2 C13.2 C66.1 D3.A IC2.4(P:V-)
VNEG_PWM: C63.1 U$2.13(PA3)
VPP_OUT: C26.1 C60.1 IC2.7(B:OUT) IC5.8 R28.1 R31.2 U$13.4(PA5) U$20.8(PA5) VPP.TP
VPP_PWM: IC2.5(B:+IN) R24.2 U$2.14(PA4)
VPP_SENS: R31.1 R32.2 U$2.18(PB0)
VSW: D2.A L10.P$2 U$15.1(SW)
X0: IC8.1(PB4) U$26.2
X1: IC8.2(PB5) U$26.3
X2: IC8.3(PB6) U$26.4
X3: IC8.4(PB7) U$26.5
X4: IC8.6(PA7) U$26.6
X5: IC8.7(PA6) U$26.7
X6: IC8.8(PA5) U$26.8
X7: IC8.16(PB3) U$27.2
X8: IC8.15(PB2) U$27.3
X9: IC8.14(PB1) U$27.4
X10: IC8.13(PB0) U$27.5
X11: IC8.11(PA0) U$27.6
X12: IC8.10(PA4) U$27.7
X13: IC8.9(PA3) U$27.8
XBOOT0: JP1.1 R3.1 U1.60(BOOT0)
XI: IC1.5(XTAL1/CLKIN) R40.2
XNRST: C61.2 R75.1 U$19.4(NRST) U$23.4
XOSC_IN: C19.2 Q4.2 U1.5(PD0_OSC_IN)
XOSC_OUT: C20.2 Q4.1 U1.6(PD1_OSC_OUT)
XPA0: U1.14(PA0-WKUP) X1.28
XPB0/ADC8: U1.26(PB0) X1.36
XPB1: U1.27(PB1) X1.38
XPB2: U1.28(PB2) X1.39
XPC0: U1.8(PC0) X1.25
XPC2: U1.10(PC2) X1.26
XPC3: U1.11(PC3) X1.27
XPC6: U1.37(PC6) X1.24
XPC7: U1.38(PC7) X1.23
XPC13: U1.2(PC13-TAMPER-RTC) X1.14
XPC14: U1.3(PC14-OSC32_IN) X1.15
XPC15: U1.4(PC15-OSC32_OUT) X1.16
XSCL: R35.1 U1.61(PB8) U$22.3 X1.6
XSDA: R37.1 U1.62(PB9) U$22.4 X1.7
XSPI_MISO: R67.1 R70.1 U1.56(PB4) X1.9
XSPI_MOSI: R68.1 R69.1 U1.57(PB5) X1.10
XSPI_SCK: R66.1 U1.55(PB3) X1.8
XSW: IC4.2(SW) L13.P$1
XUSBDM: R12.2 U1.44(PA11)
XUSBDP: R14.2 U1.45(PA12)
XVDDA: C7.1 C12.2 L1.2 U1.13(VDDA)
XXNRST: R1.2 S1.P$2 U1.7(NRST)
Unconnected: H1.B3,2(MOUNT) H2.B3,2(MOUNT) H3.B3,2(MOUNT) H4.B3,2(MOUNT) H5.B3,2(MOUNT) H6.B3,2(MOUNT) H7.B3,2(MOUNT) IC1.4(XTAL2) IC1.10(RXERR/PHYAD0) J3.2 U2.4(SENSOR_VP) U2.5(SENSOR_VN) U2.6(IO34) U2.7(IO35) U2.8(IO32) U2.9(IO33) U2.10(IO25) U2.11(IO26) U2.12(IO27) U2.13(IO14) U2.14(IO12) U2.16(IO13) U2.17(SD2) U2.18(SD3) U2.19(CMD) U2.20(CLK) U2.21(SDO) U2.22(SD1) U2.23(IO15) U2.24(IO2) U2.26(IO4) U2.27(IO16) U2.28(IO17) U2.32(NC) U2.33(IO21) U2.36(IO22) U$2.10(PA0) U$2.11(PA1) U$2.12(PA2) U$2.16(PA6) U$2.17(PA7) U$2.20(PB2) U$2.21(PB10) U$2.22(PB11) U$2.25(PB12) U$2.26(PB13) U$2.28(PB15) U$2.29(PA8) U$2.45(PB8) U$2.46(PB9) U$20.1(PB4) U$20.2(PB5) U$20.3(PB6) U$20.4(PB7) U$20.13(PB0) U$20.14(PB1) U$20.15(PB2) U$20.16(PB3) U$29.14(PB1) USB1.BODY@1(BODY) USB1.BODY@2(BODY) USB1.BODY@3(BODY) USB1.BODY@4(BODY) USB1.P4(USBID) USB2.BODY@1(BODY) USB2.BODY@2(BODY) USB2.BODY@3(BODY) USB2.BODY@4(BODY) USB2.P4(USBID) USB3.BODY@1(BODY) USB3.BODY@2(BODY) USB3.BODY@3(BODY) USB3.BODY@4(BODY) USB3.P4(USBID)

## Notes on the sheet
- -2.4V
- STM32F070F6
- ALD192/1-1 | ALD192/1-1
- PADAUK Programmer | PADAUK Programmer
- ALD192/2-1 | ALD192/3-1
- AUDIO player
- Battery-powered
  STM32030
- REVER load
- ALD192/4-1 | ALD192/9-1
- ETH Bridge | ETH Bridge
- Attiny switch
- USB connector
- OLED
- Ethernet PHY, Magnetics | ALD192/8-1
- ALD192/4-1 | ALD192/4-1
- ETH Bridge | ETH Bridge | NFC USBizer
- 2V
- 15mA
- ALD192/5-1 | ALD192/6-1 | ALD192/7-1
- LCD Display | STEP UP Adjustable | PADAUK breakout
- ALD192/10-1
- SOIC16/TSSOP16 Addaptor

## Library data of the parts
BOOT1 BOOT2 JP1-JP3 JP5-JP11 = alvie:PIN-1X2
C1-C82 = GadgetFactory:C: CAPACITOR, European symbol
D1 = alvie:1N4148W
D2 = dp_devices:DIODE: Various Diode Packages
D3 D4 = GadgetFactory:DIODE-SCHOTTKY
H1-H7 = holes:MOUNT-PAD-ROUND: MOUNTING PAD, round
IC1 = sigedi-footprints:LAN8720A
IC2 = linear:LM358: OP AMP also LM158; LM258; LM2904 Source: http://cache.national.com/ds/LM/LM158.pdf
IC3 = dp_devices:IC_DIL16: Universal 16 pins IC
IC4 = alvie:TPS6206*
IC5 = ic-package:DIL16: Dual In Line / Socket
IC6 IC7 = 40xx:4051: 8-channel ANALOG MULTIPLEXER
IC8 U$7 U$20 = alvie:PFS154-S16
IC9 U3 U$28 = alvie:MIC550X
J1 J4 = SparkFun-Connectors:CONN_02: Multi connection point. Often used as Generic Header-pin footprint for 0.1 inch spaced/style header connections On any of the 0.1 inch spaced packages, you can populate with these: Break Away Headers - Straight <https://www.sparkfun.com/products/116> (PRT-00116) Break Away Male Headers - Right Angle <https://www.sparkfun.com/products/553> (PRT-00553) Female Headers <https://www.sparkfun.com/products/115> (PRT-00115) Break Away Headers - Machine Pin <https://www.sparkfun.com/products/117> (PRT-00117) Break Away Female Headers - Swiss Machine Pin <https://www.sparkfun.com/products/743> (PRT-00743) For SCREWTERMINALS and SPRING TERMINALS visit here: Screw Terimnals on SparkFun.com <https://www.sparkfun.com/search/results?term=Screw+Terminals> (5mm/3.5mm/2.54mm spacing) This device is also useful as a general connection point to wire up your design to another part of your project. Our various solder wires solder well into these plated through hole pads. Hook-Up Wire - Assortment (Stranded, 22 AWG) <https://www.sparkfun.com/products/11375> (PRT-11375) Hook-Up Wire - Assortment (Solid Core, 22 AWG) <https://www.sparkfun.com/products/11367> (PRT-11367) View the entire wire category on our website here <https://www.sparkfun.com/categories/141> Special notes: Molex polarized connector foot print use with: PRT-08233 with associated crimp pins and housings. 2.54_SCREWTERM for use with PRT-10571. 3.5mm Screw Terminal footprints for PRT-08084 5mm Screw Terminal footprints for use with PRT-08432; PROD_ID: CONN-09863; SKU: PRT-09914
J2 J5 = dp_devices:JUMPER_SOLDER_1X2
J3 = GadgetFactory:JACK-PLUG: DC POWER JACK Power Jack, DC, Right Angle, Through Hole, Rated 5A at 16VDC, PC Terminals Distributor: Farnell (www.Farnell.de) Drawing: 84N1161.pdf / 84N1162.pdf Manufacturer: SPC Technology (www.spctechnology.com) Type: SPC4077 / SPC 4078
J6 = SparkFun-Connectors:AVR_SPI_PRG_6: AVR ISP 6 Pin This is the reduced ISP connector for AVR programming. Common on Arduino. This footprint will take up less PCB space and can be used with a 10-pin to 6-pin adapter such as SKU: BOB-08508
JP4 = alvie:PIN-1X3
JP12 JP13 U$6 U$11 U$21 U$23 = alvie:PIN-1X8
L1-L9 L11 L12 L14 = GadgetFactory:L: INDUCTOR, European symbol
L10 L13 = alvie:DFE252012F
LED1-LED6 = dp_devices:LED: Light Emitting Diode
M1-M3 = alvie:XT1861B
P1 P2 = con-jst-ph:B3B-PH-K: HEADER
Q1-Q3 Q5 Q7 Q10 = transistor-small-signal:BSS84: P-CHANNEL MOS FET
Q4 Q6 Q11 = crystal:CRYSTAL: CRYSTAL; OC_FARNELL: 1666969; OC_NEWARK: unknown
Q8 = transistor-small-signal:BSS123: N-CHANNEL MOS FET
Q9 = transistor-power:FDN360P: Single P-Channel, PowerTrench (R) MOSFET Source: http://www.fairchildsemi.com/ds/FD/FDN360P.pdf
R1-R83 = GadgetFactory:R: RESISTOR, European symbol
S1-S3 = EAGLE_BoosterPack_Library:SWITCHES_: Various NO switches- pushbuttons, reed, etc
SJ1 = headers:SOLDERJUMPER: Solder Jumper Standard SMD solder jumper. Used to automate production. Two varients : Normally Open and Normally Closed are the same, but have different paste layers. NC will have a large amount of paste and should jumper during reflow.
T1 = alvie:HR913550A
TP11-TP18 TP20-TP29 VDD VPP = testpad:TP: Test pad
U1 = ST Microelctronics_By_element14_Batch_1:STM32F107RCT6: ARM-based 32-bit MCU; MPN: STM32F107RCT6; OC_FARNELL: 1737139; OC_NEWARK: 25R9444; PACKAGE: LQFP-64; SUPPLIER: STMicroelectronics
U2 = esp32:ESP-WROOM-32
U4 = Atmel_By_element14_Batch_1-00:ATTINY24A-SSU: 8-bit Microcontroller with In-System Programmable Flash; MPN: ATTINY24A-SSU; OC_FARNELL: 1699395; OC_NEWARK: 80P3681; PACKAGE: SOIC-14; SUPPLIER: Atmel
U$1 U$8 U$10 U$12 U$22 U$30 = alvie:PIN-1X4
U$2 = alvie:STM32F072CBT6
U$3 = alvie:SR410361N
U$4 = alvie:STM8S003F3P6
U$5 = alvie:P25QXH
U$9 = alvie:TSSOP16
U$13 = alvie:PMS150C-U06
U$14 = alvie:AP2000
U$15 = alvie:MT3608
U$16-U$18 U$26 U$27 = alvie:PIN-1X10
U$19 = alvie:STM32F030F4P6
U$25 = alvie:PN532_NFC
U$29 = alvie:STM32F070F6
USB1-USB3 = dp_devices:CON-USB-F: USB Female connector
X1 X2 = con-hirose:FH12-40S-0.5S: 0.5mm Pitch Connectors For FPC/FFC Source: Data sheet <http://www.hirose.co.jp/cataloge_hp/e58605370.pdf>; MPN: FH12-40S-0.5SH(55); OC_FARNELL: 1324556; OC_NEWARK: 34M6178

## Net classes
1 power: width 0.254 mm, drill 0.25 mm